# EasyEDA Pro project Proiect_PM.eprj

# Schematic ProiectPM

## Sheets
1 Anexa1: Unitatea Centrala: Board Name: Board1; Create Date: 2024-12-13; Page Name: Anexa1: Unitatea Centrala; Project Name: Proiect_PM; Schematic Name: ProiectPM; Update Date: 2025-01-07; Company: Universitatea Politehnica; Drawn: Duta Alexandru; Page Size: A4; Version: V1.0
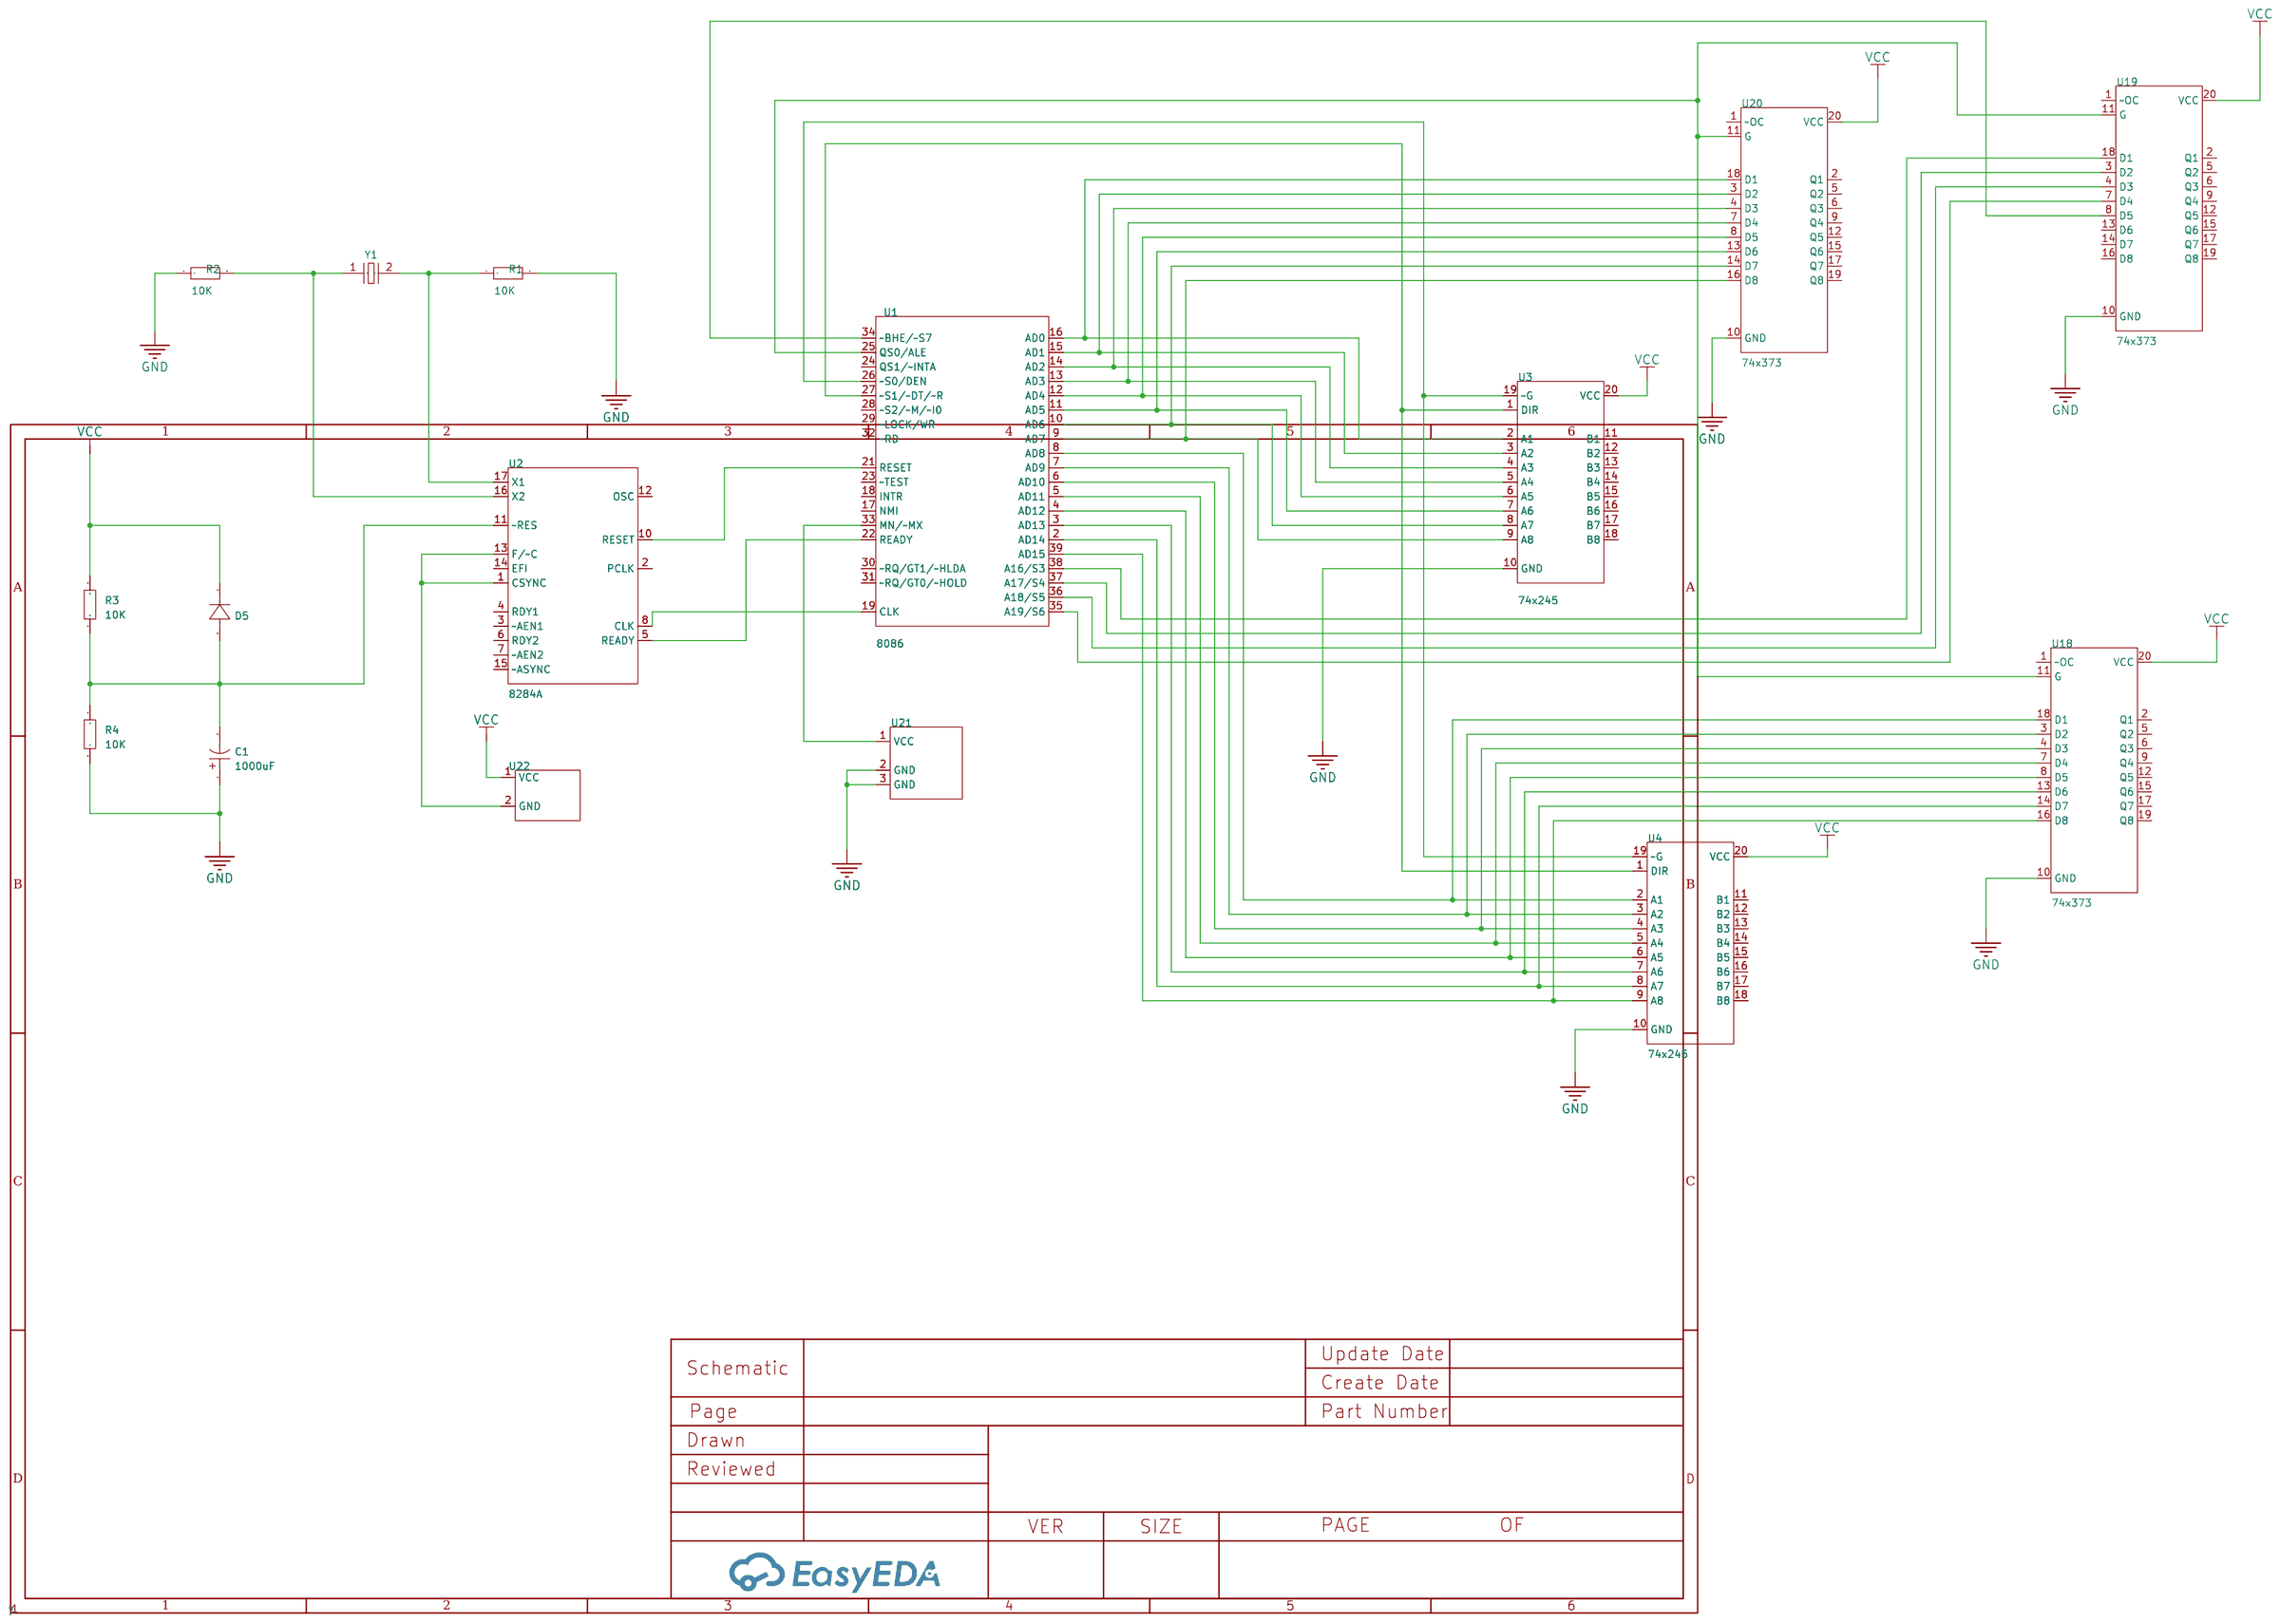
[diagram p0: Anexa1: Unitatea Centrala]
2 Anexa2:Memoriile: Create Date: 2024-12-15; Page Name: Anexa2:Memoriile
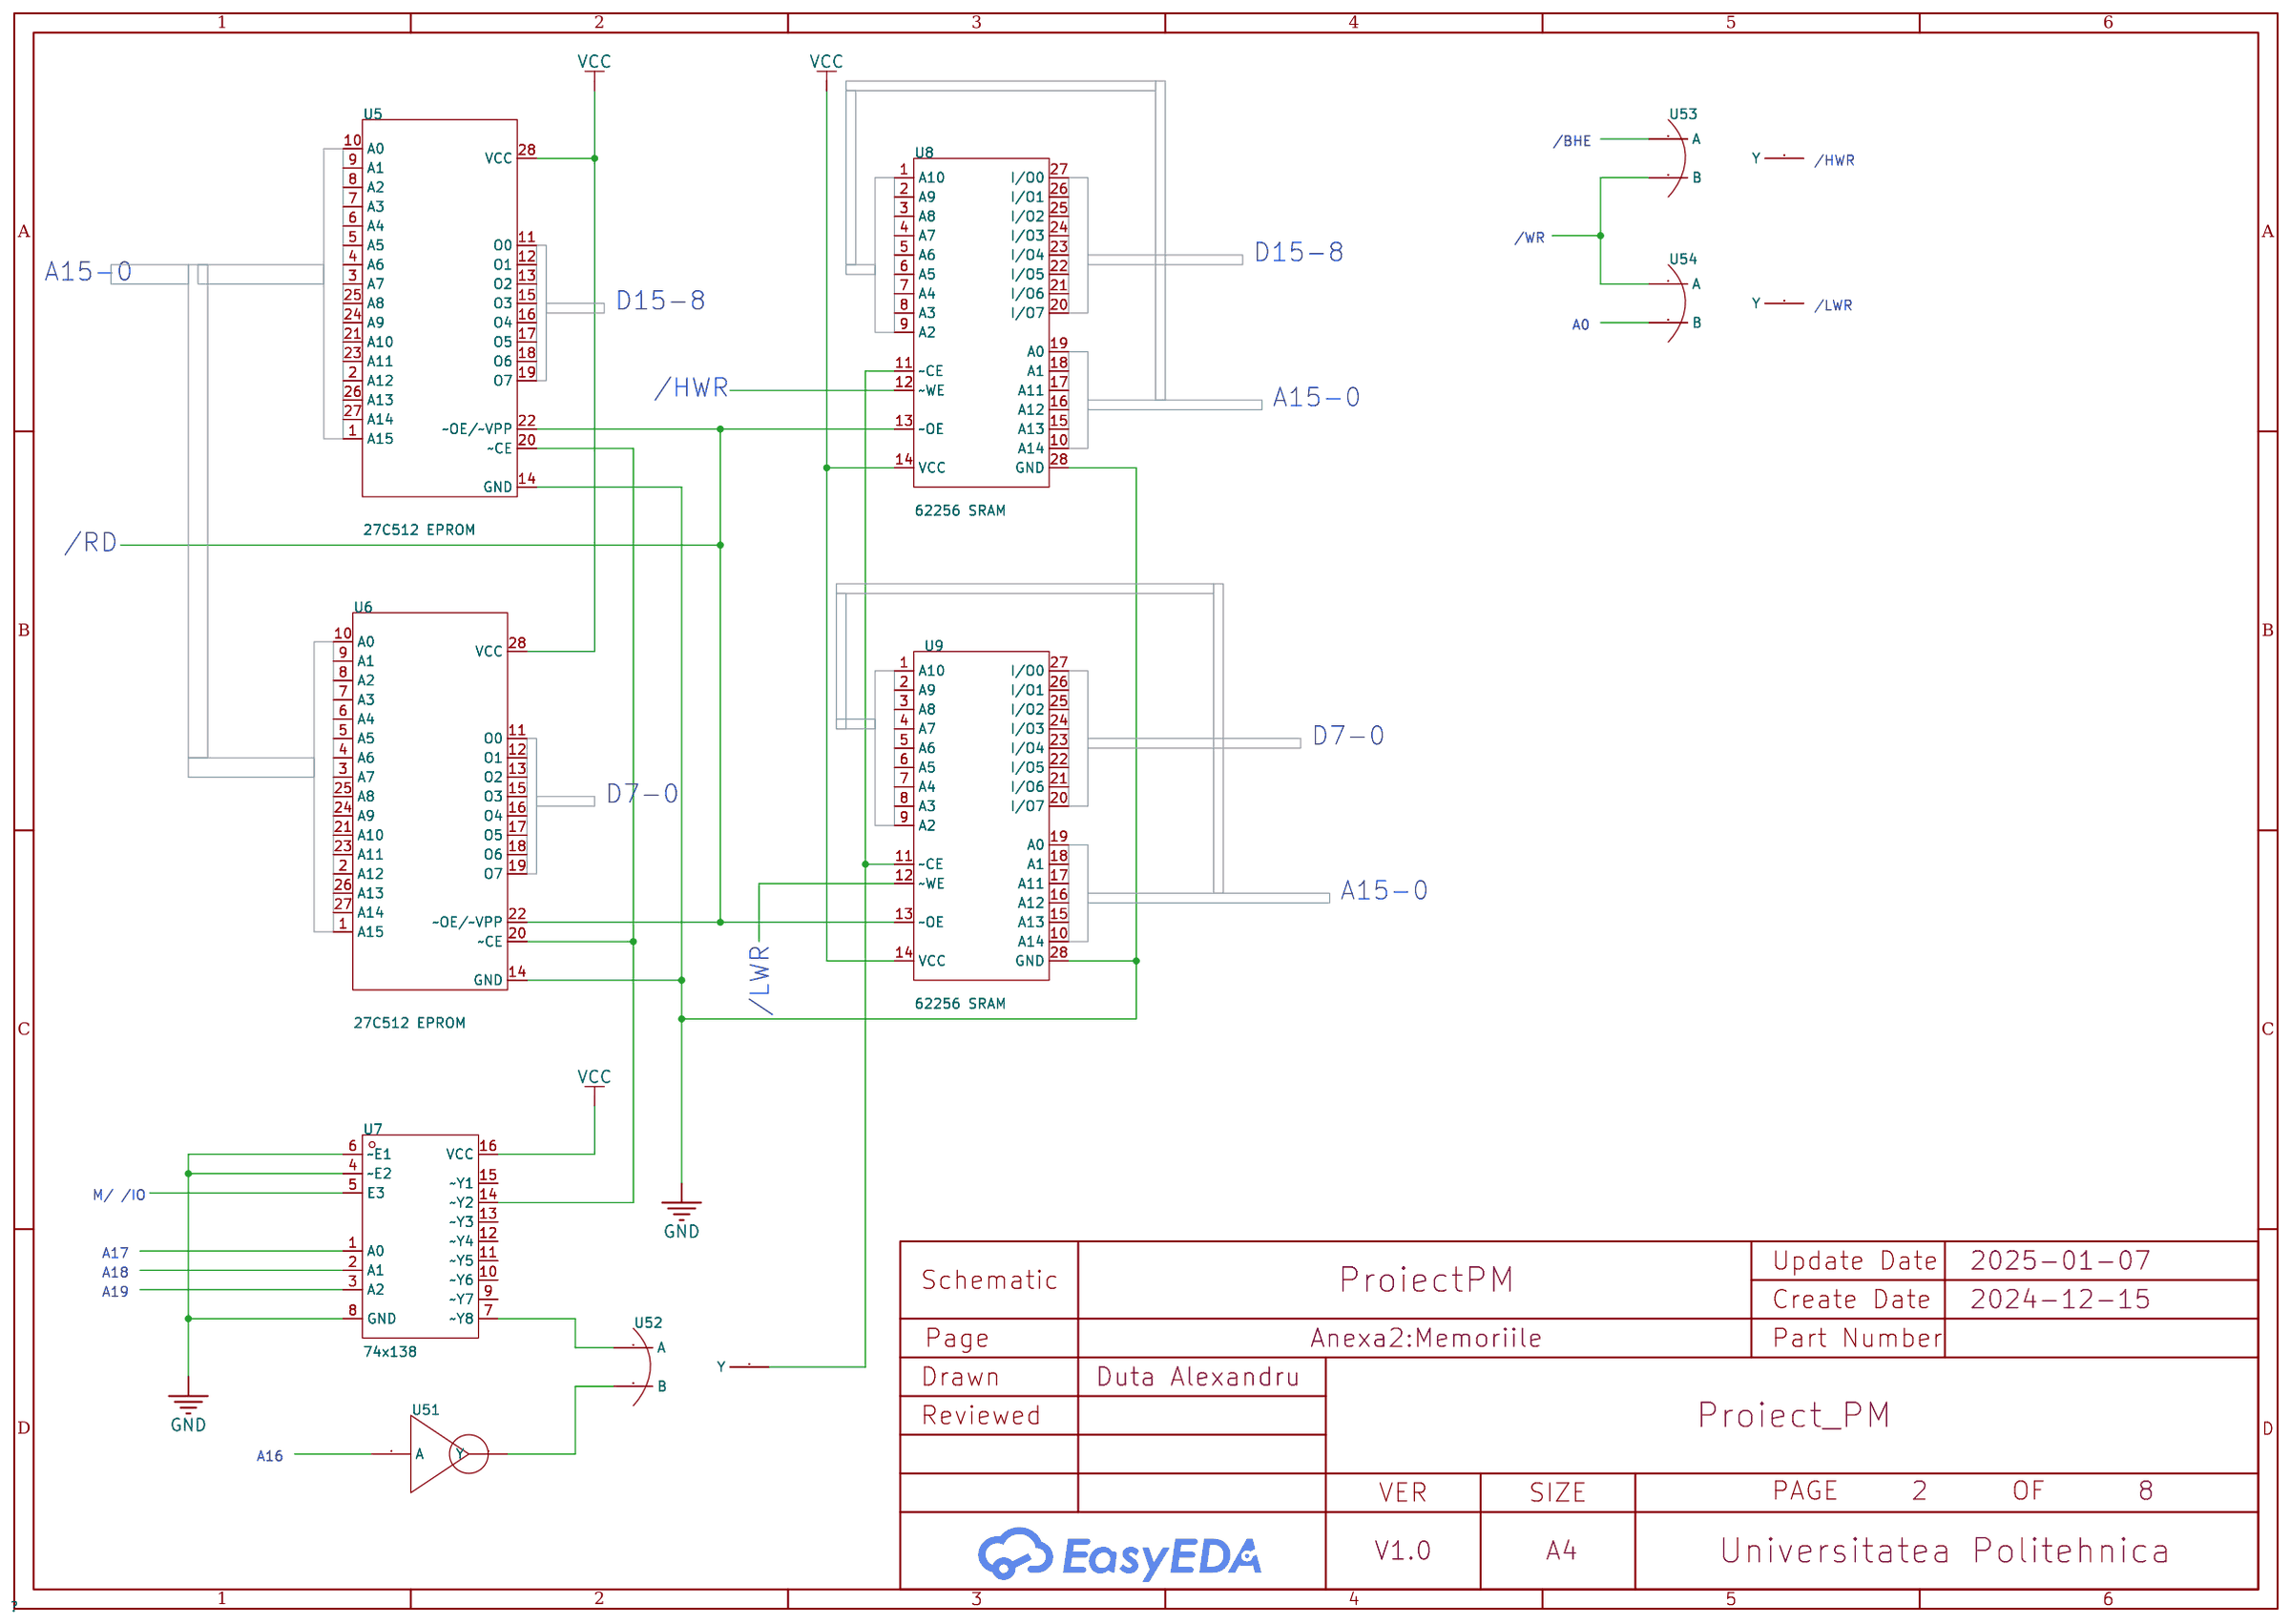
[diagram p1: Anexa2:Memoriile]
3 Anexa3:Decodificarea Porturilor: Create Date: 2024-12-15; Page Name: Anexa3:Decodificarea Porturilor
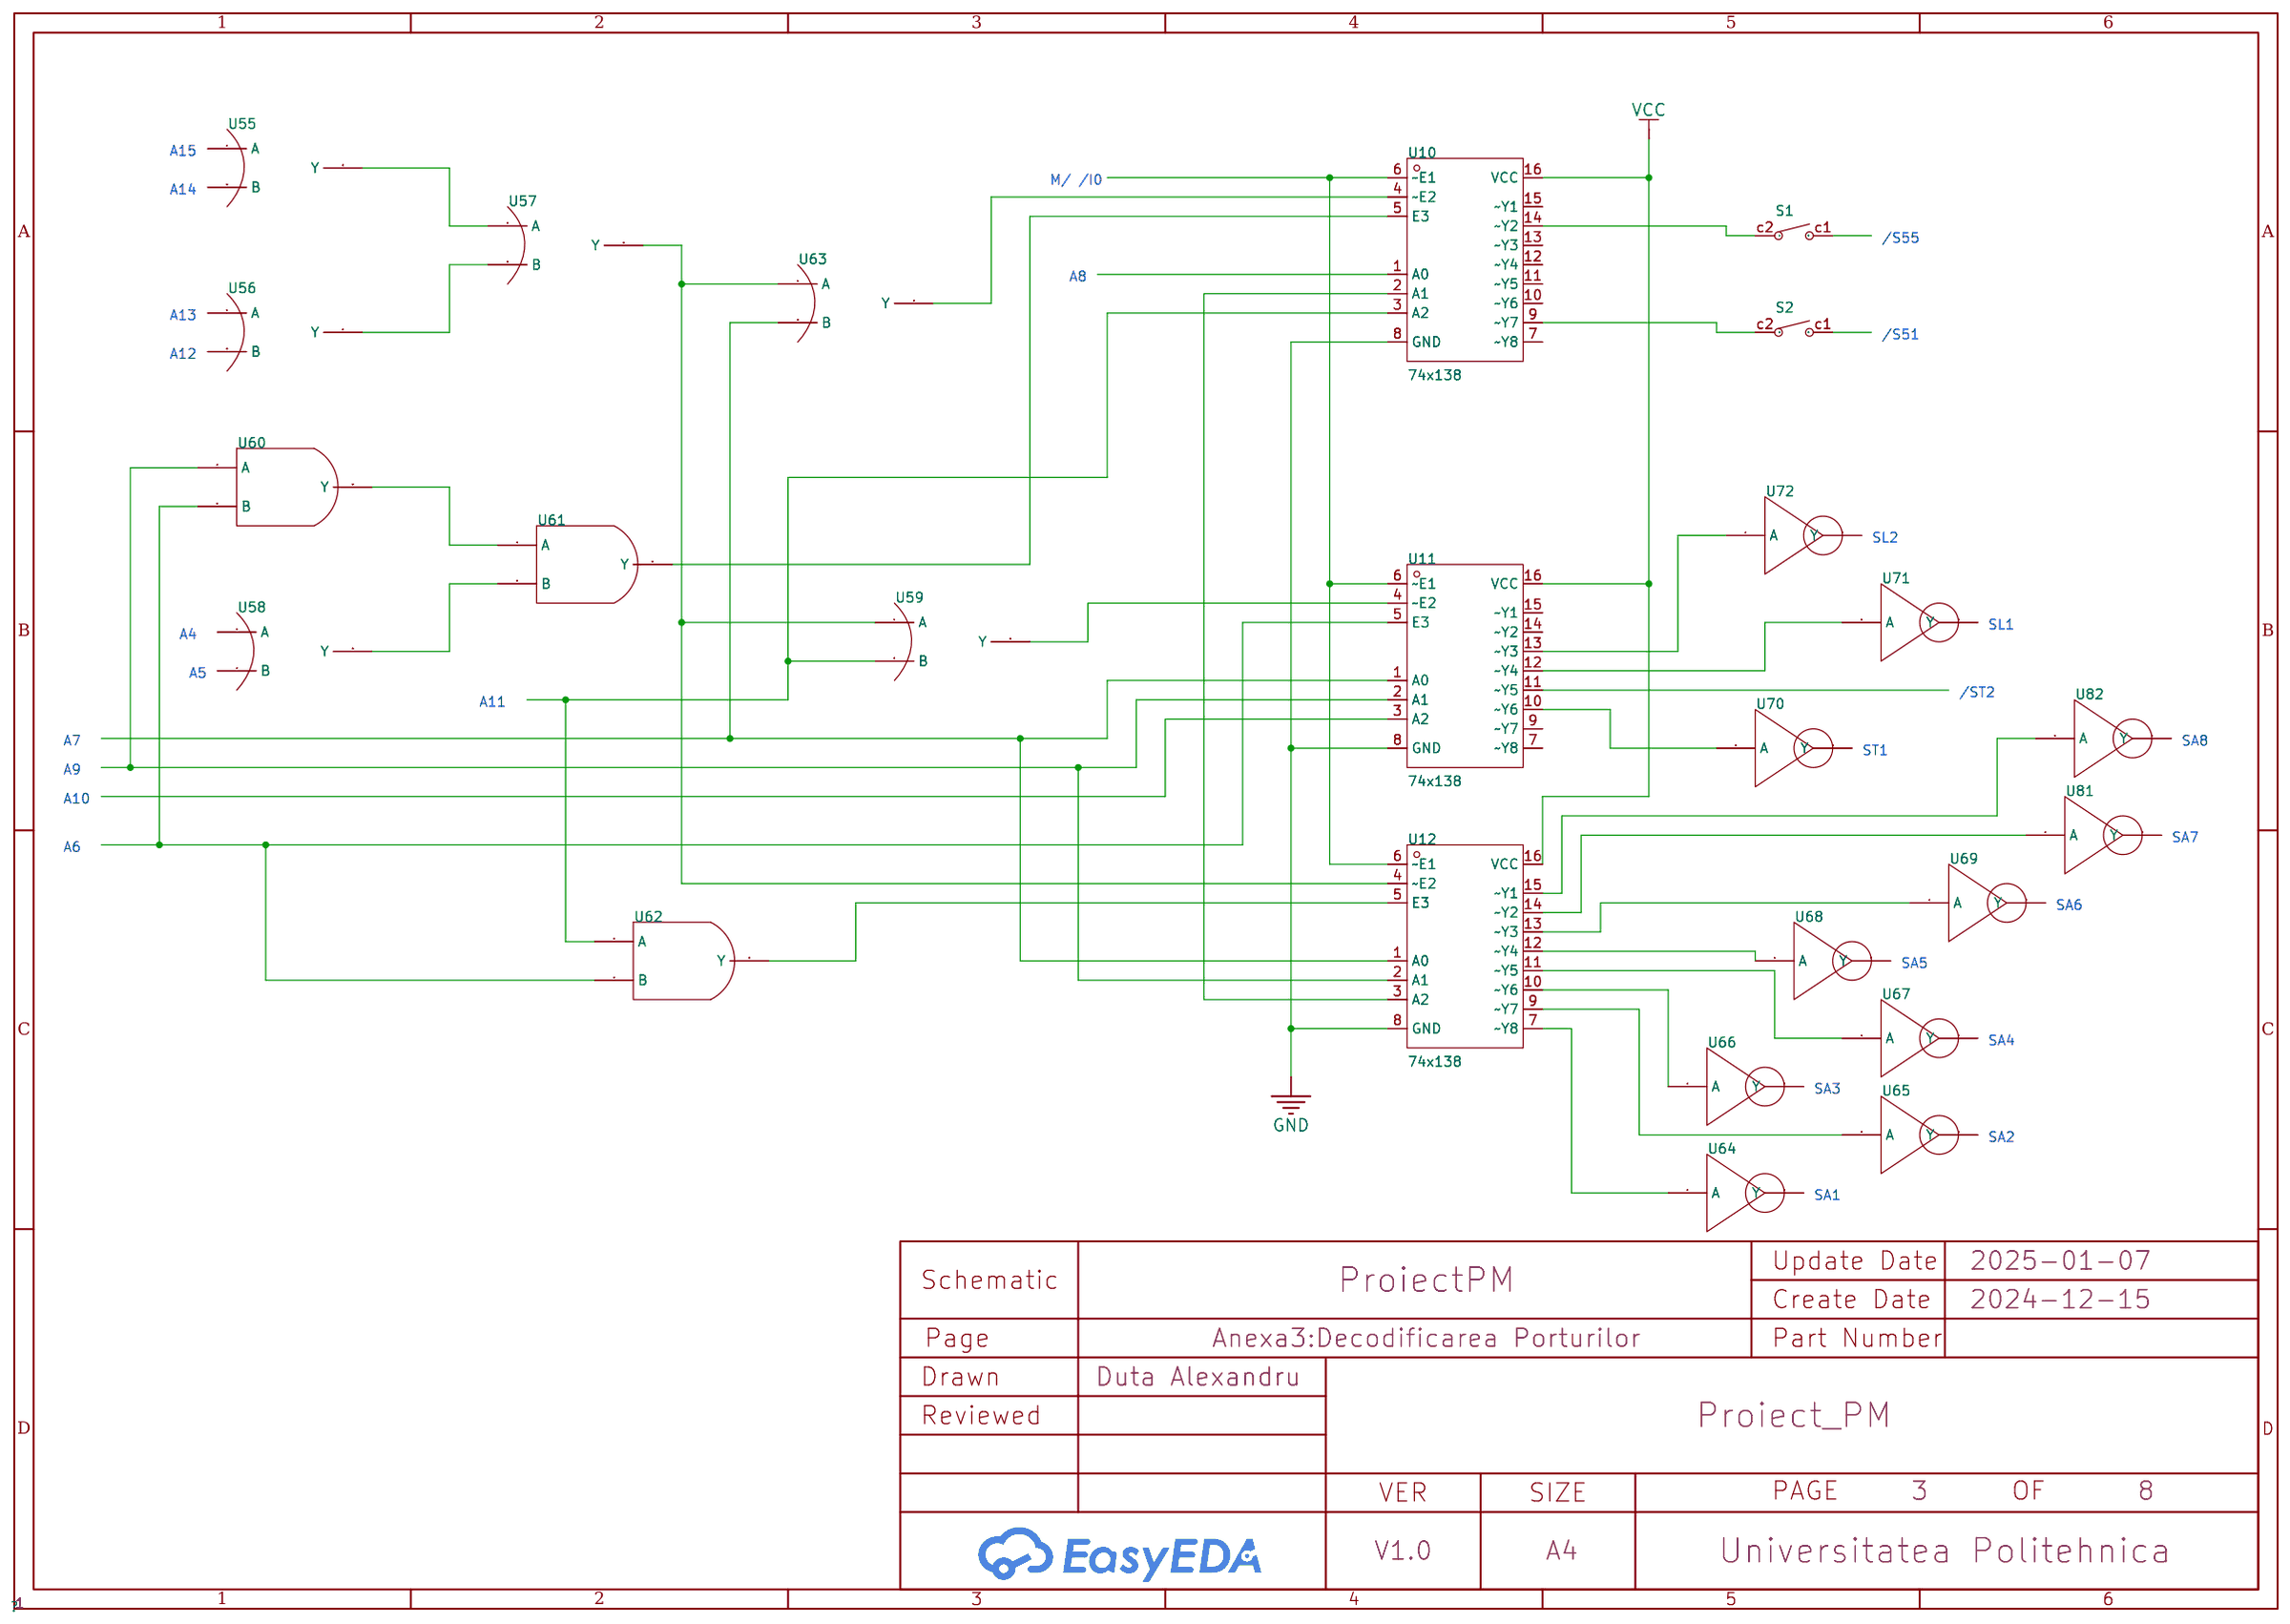
[diagram p2: Anexa3:Decodificarea Porturilor]
4 Anexa4:Interfetele: Create Date: 2024-12-15; Page Name: Anexa4:Interfetele; Update Date: 2024-12-17
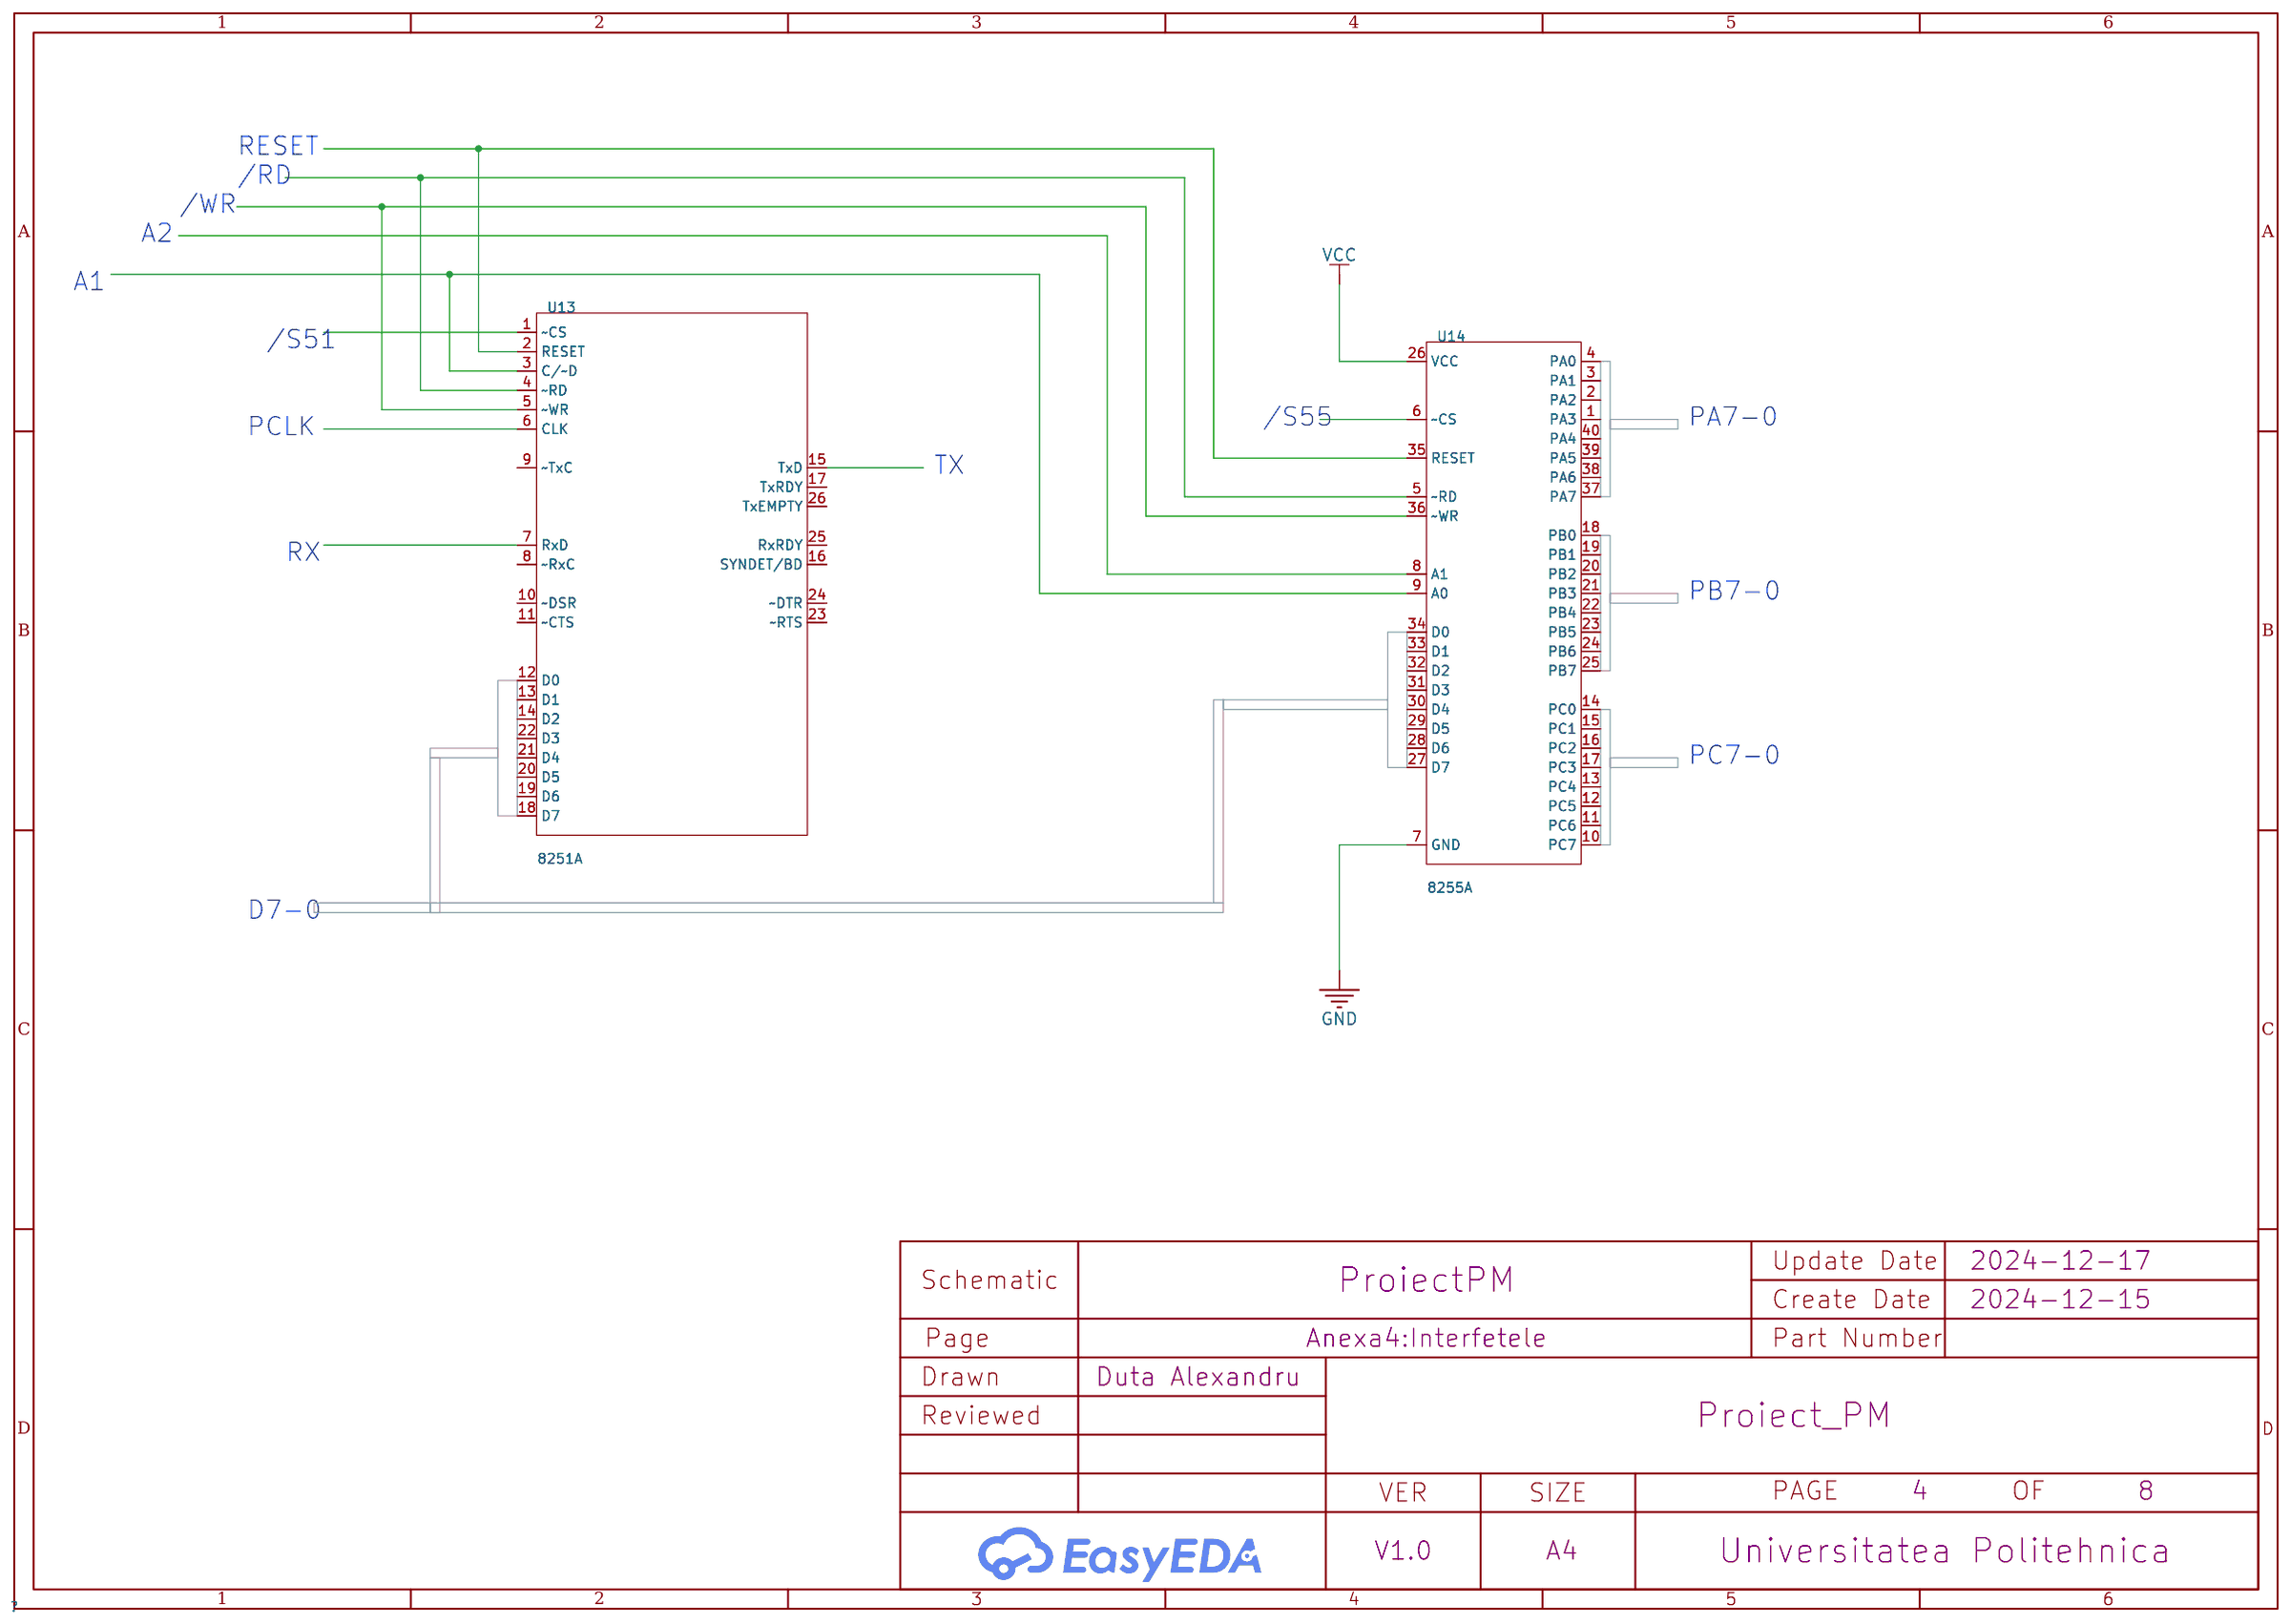
[diagram p3: Anexa4:Interfetele]
5 Anexa5:Led: Create Date: 2024-12-15; Page Name: Anexa5:Led
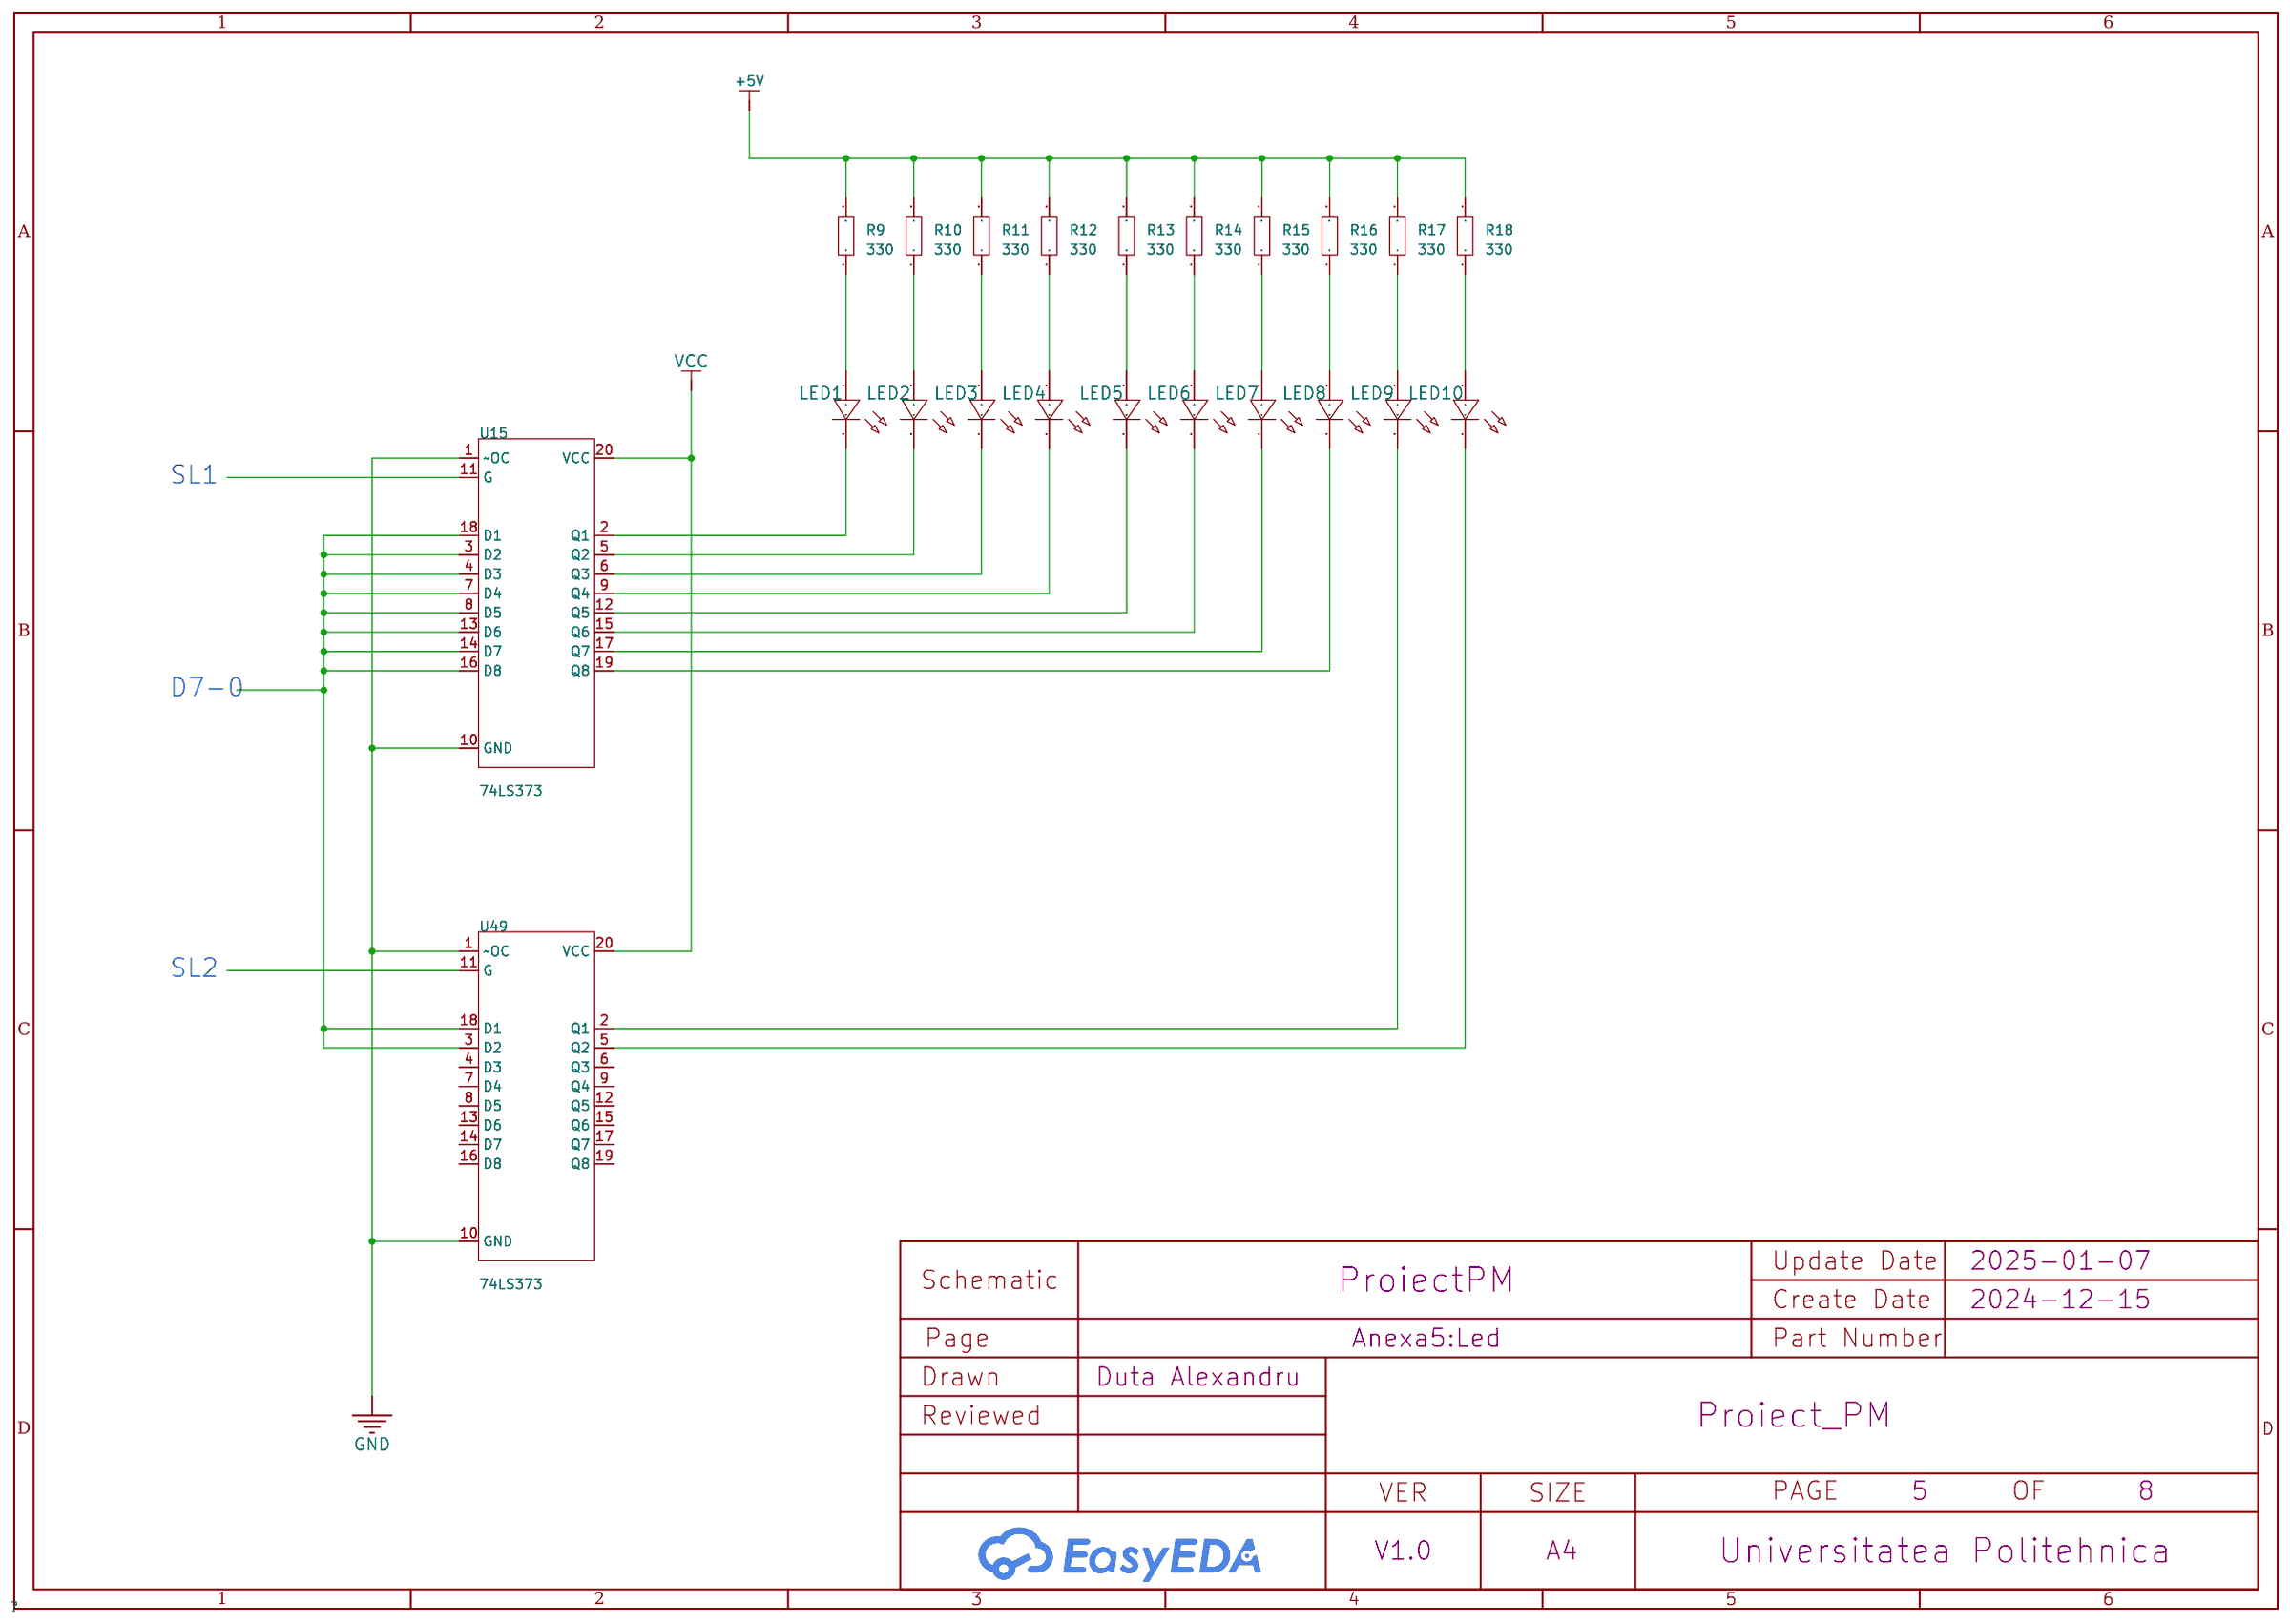
[diagram p4: Anexa5:Led]
6 Anexa7:Minitastatura cu 9 contacte: Create Date: 2024-12-15; Page Name: Anexa7:Minitastatura cu 9 contacte; Update Date: 2025-01-08; Company: EasyEDA.com
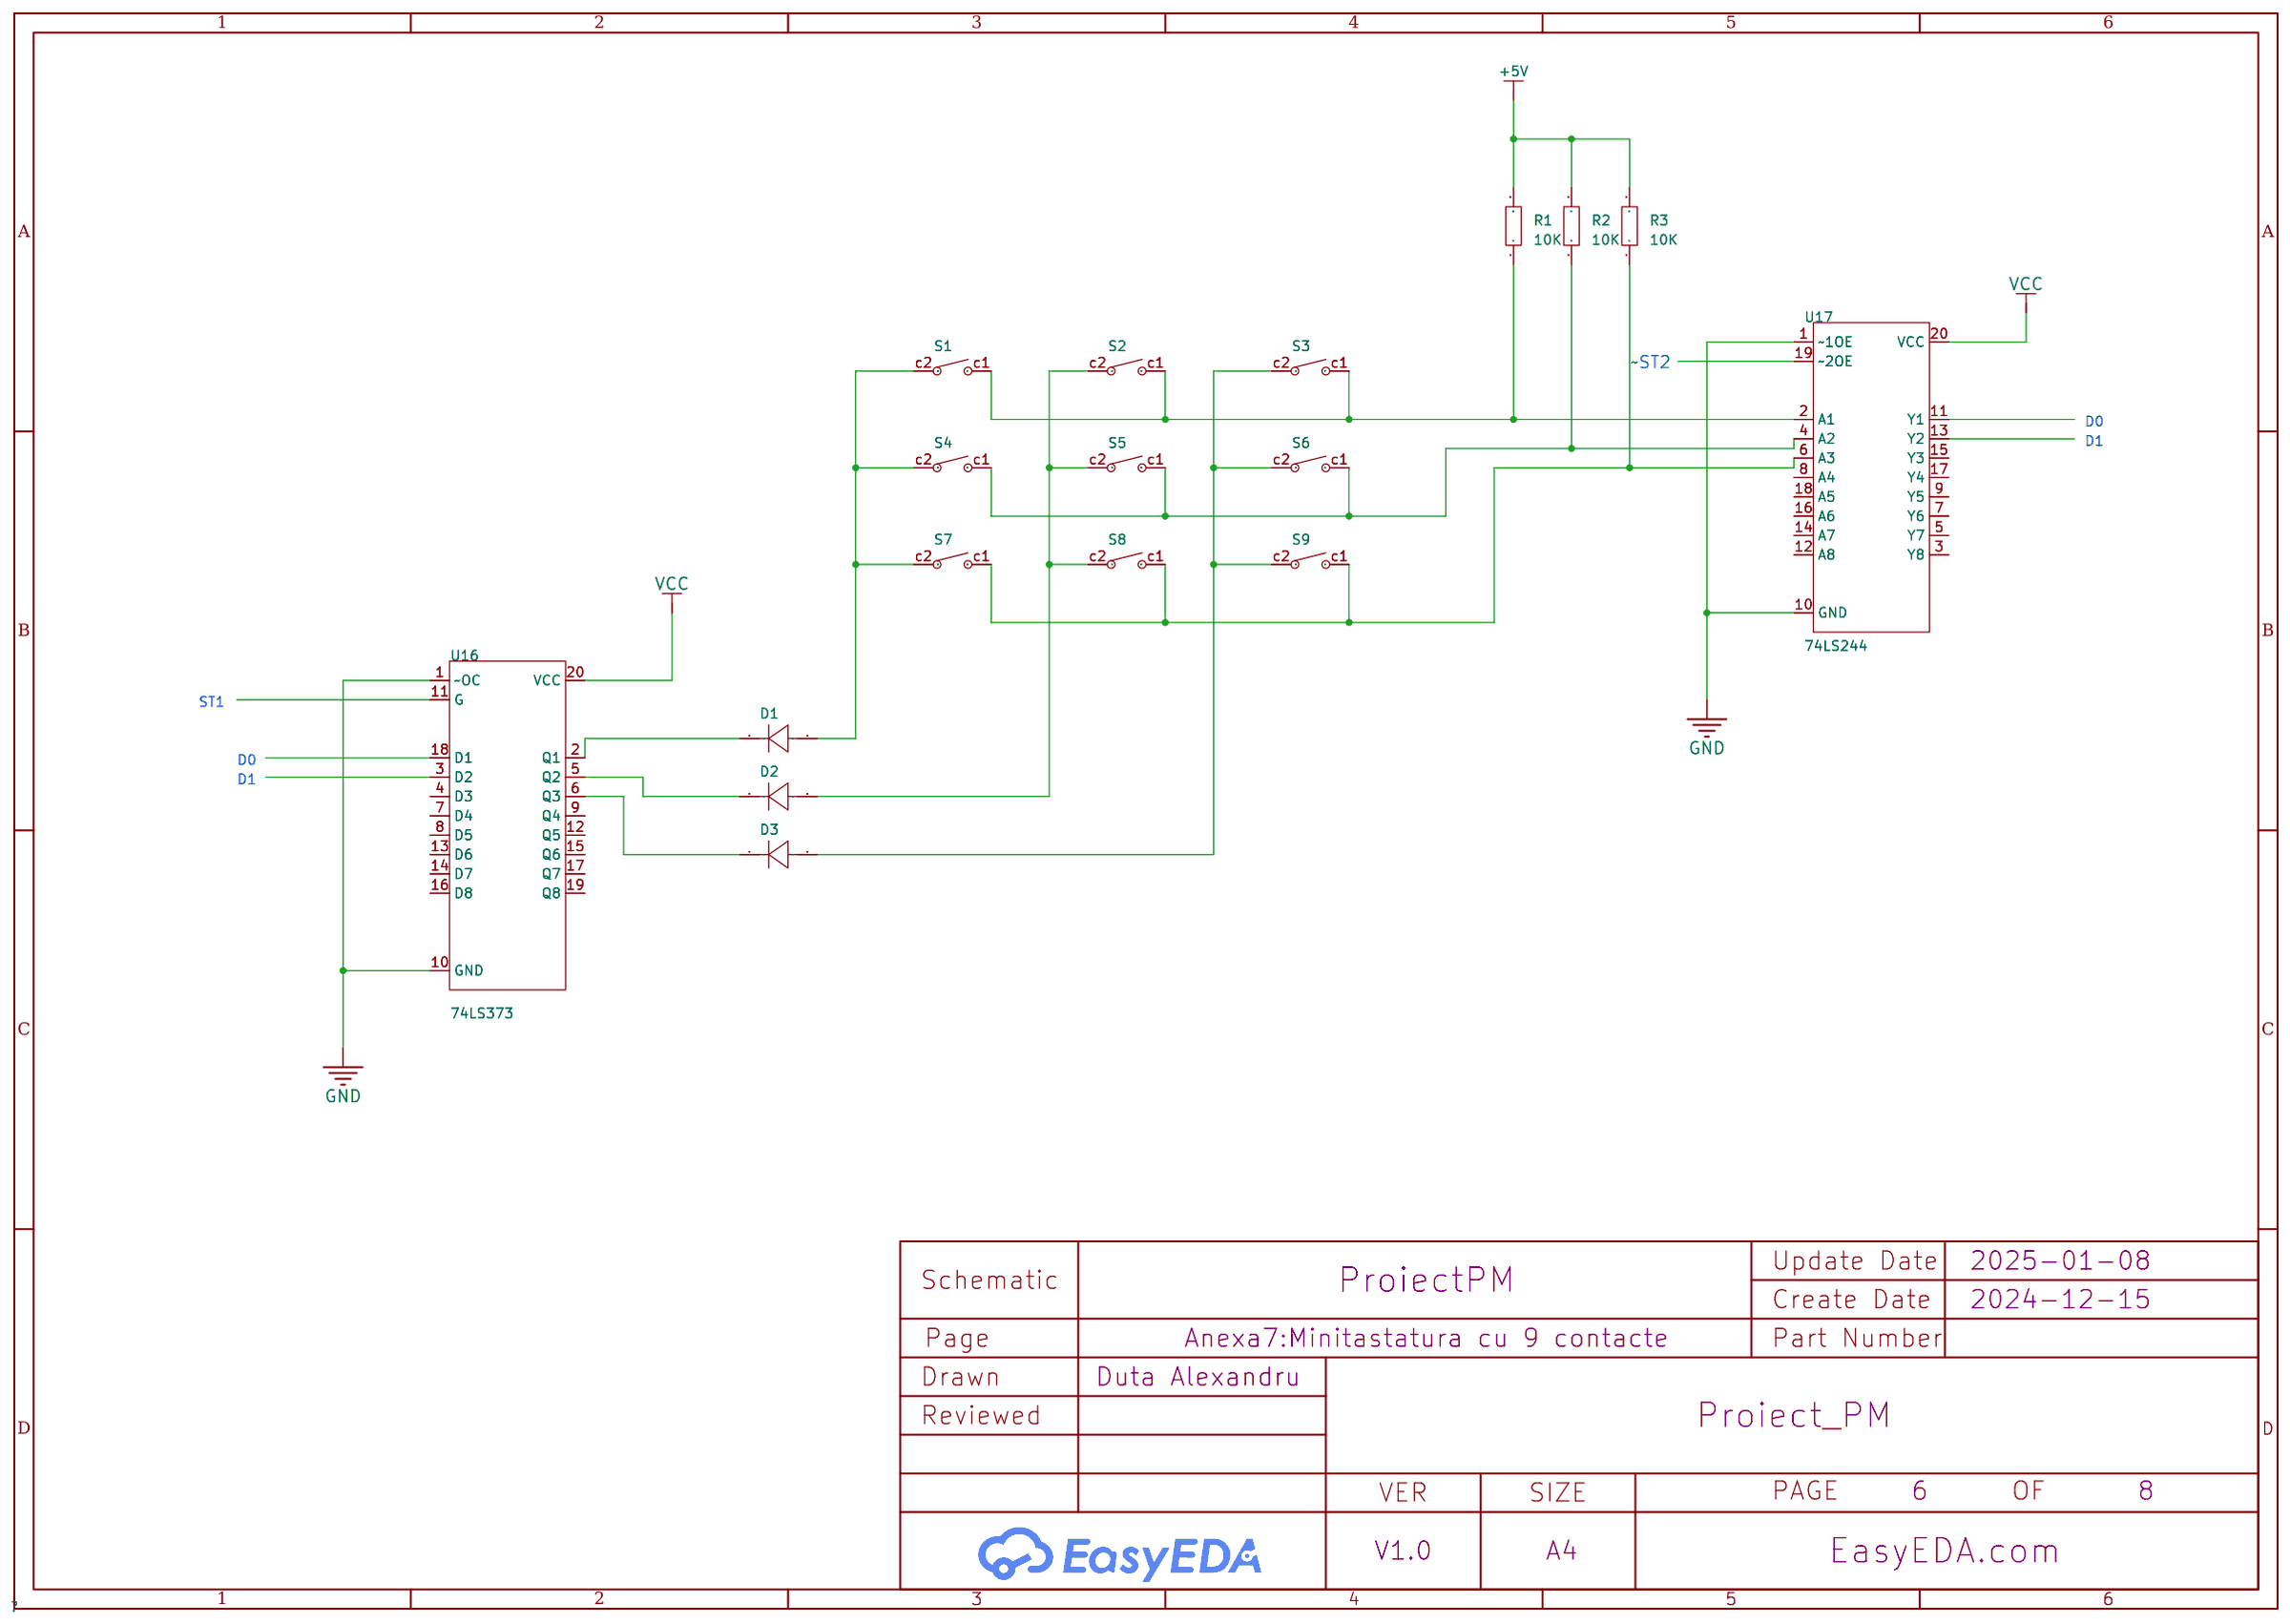
[diagram p5: Anexa7:Minitastatura cu 9 contacte]
7 Anexa6:Afisaj7segmente: Create Date: 2024-12-16; Page Name: Anexa6:Afisaj7segmente; Update Date: 2025-01-08; Page Size: A3
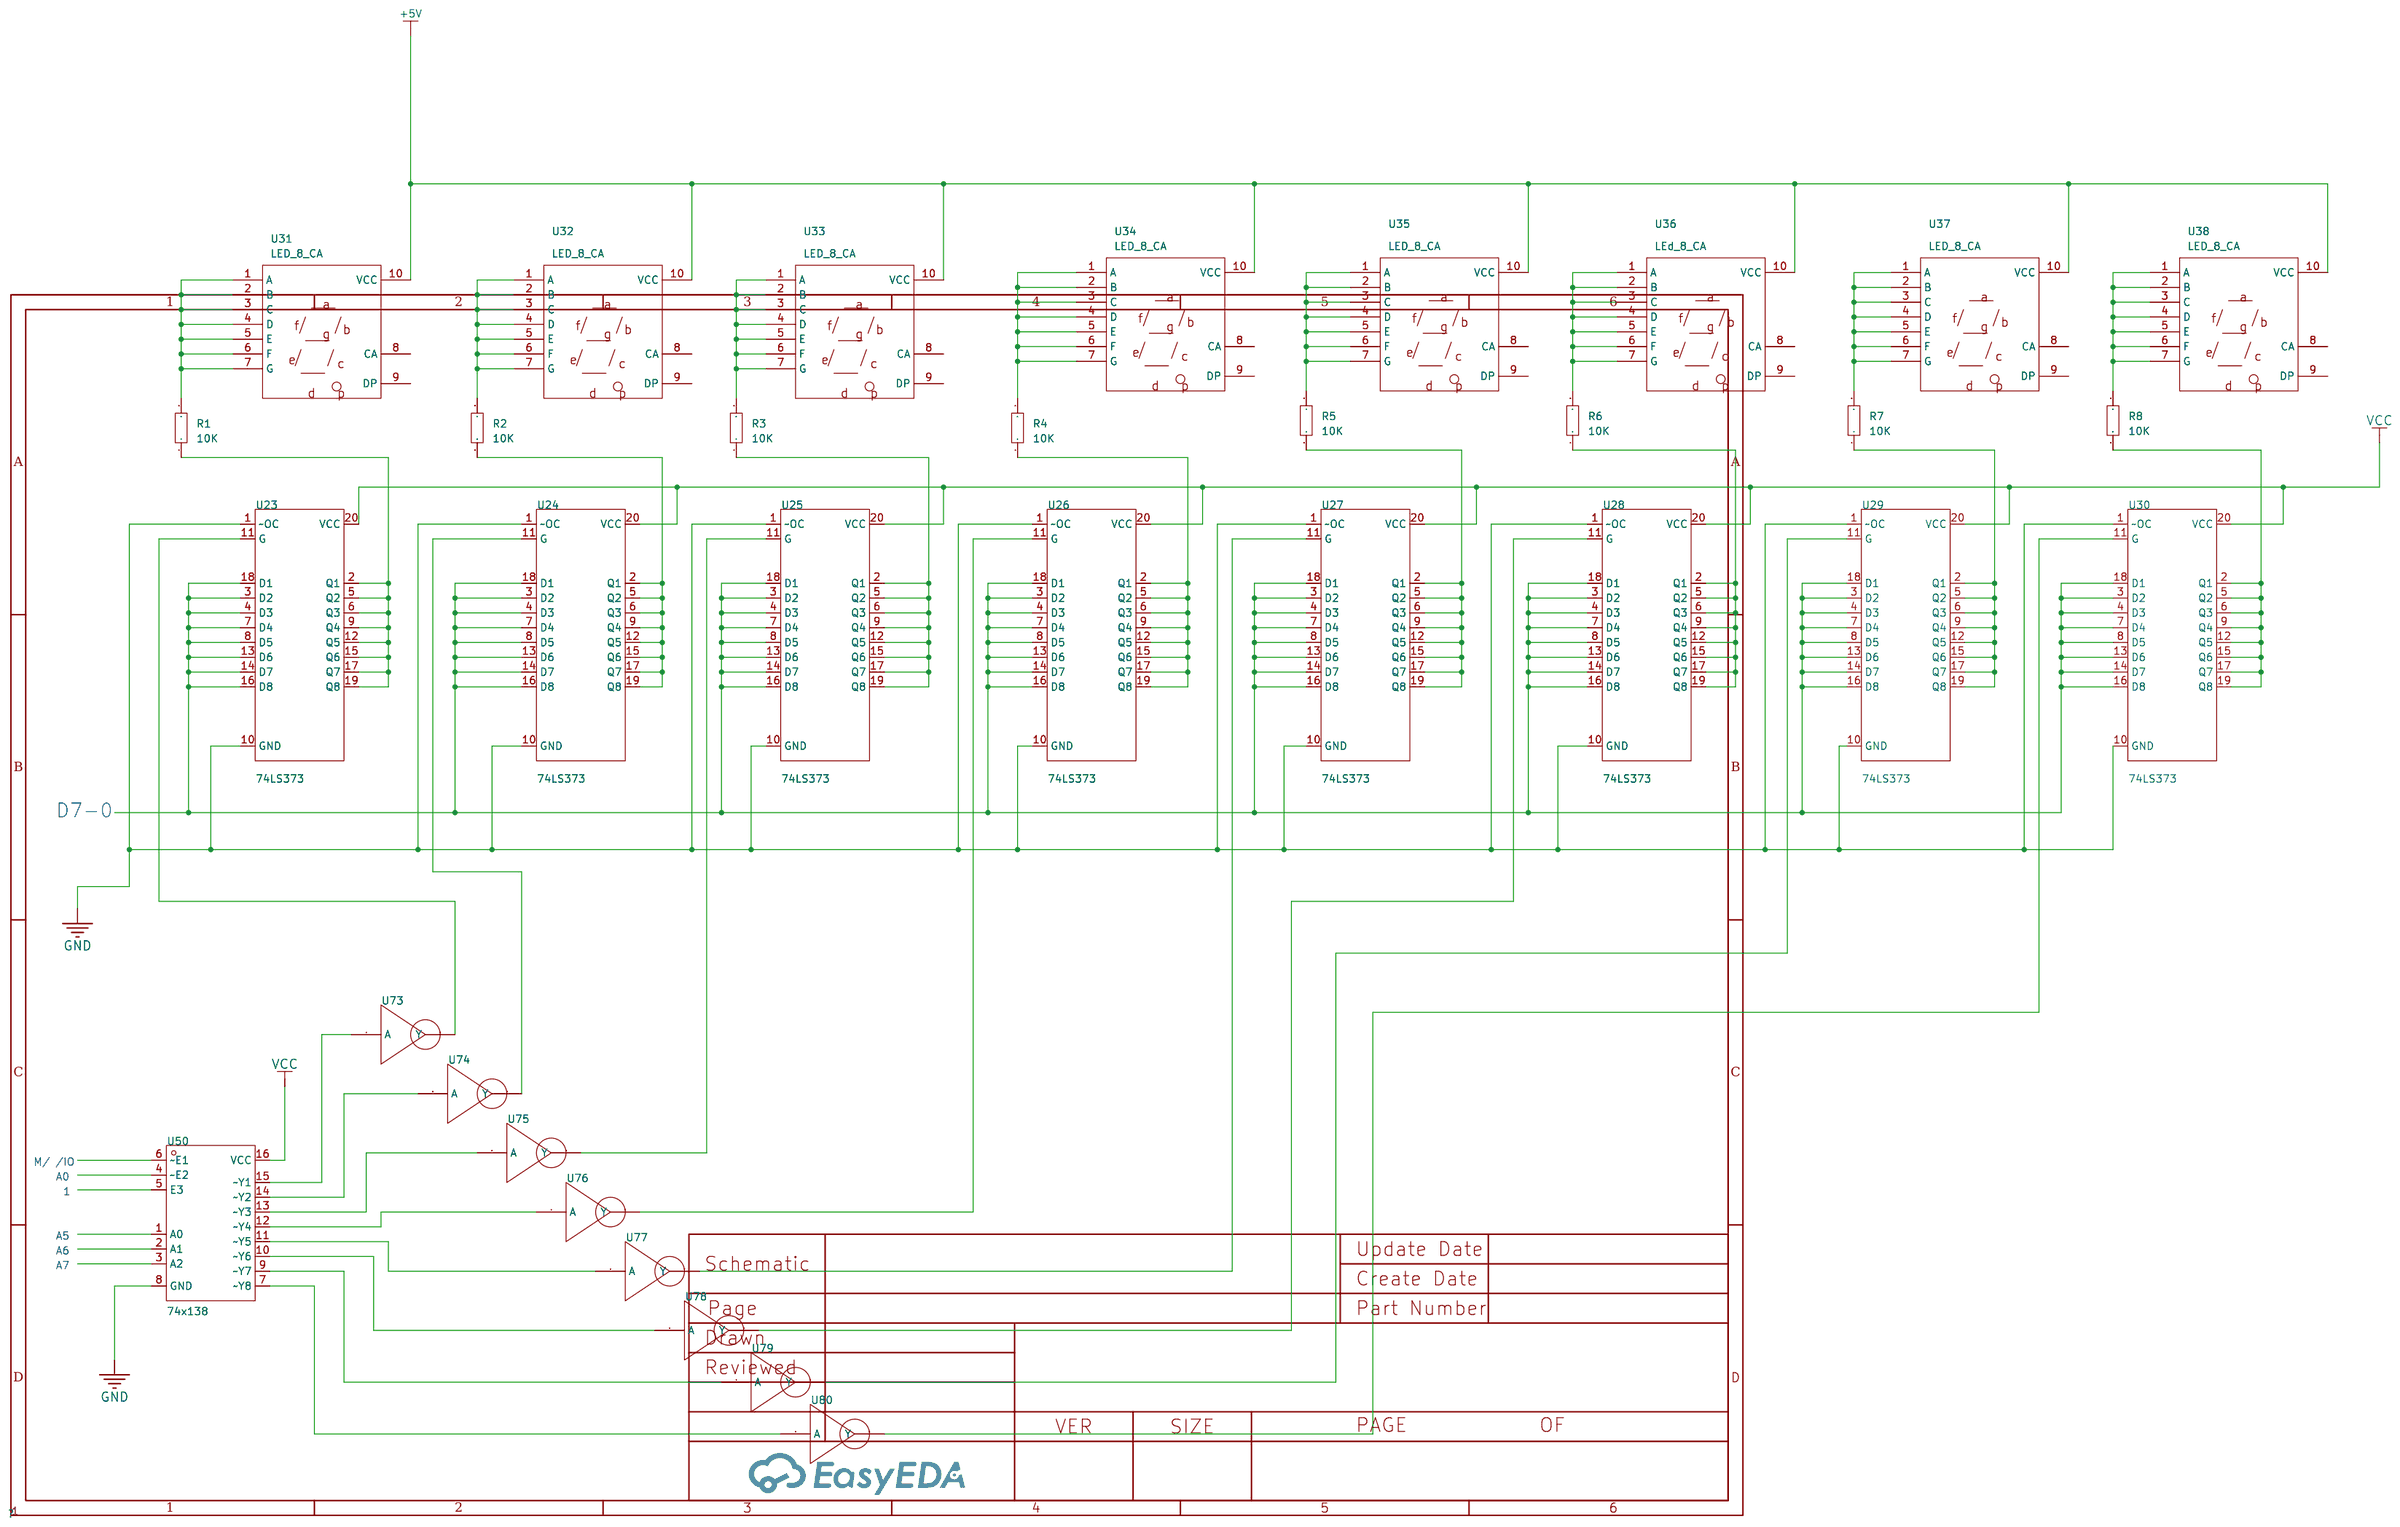
[diagram p6: Anexa6:Afisaj7segmente]
8 Anexa8:LCD: Create Date: 2024-12-16; Page Name: Anexa8:LCD; Update Date: 2025-01-03
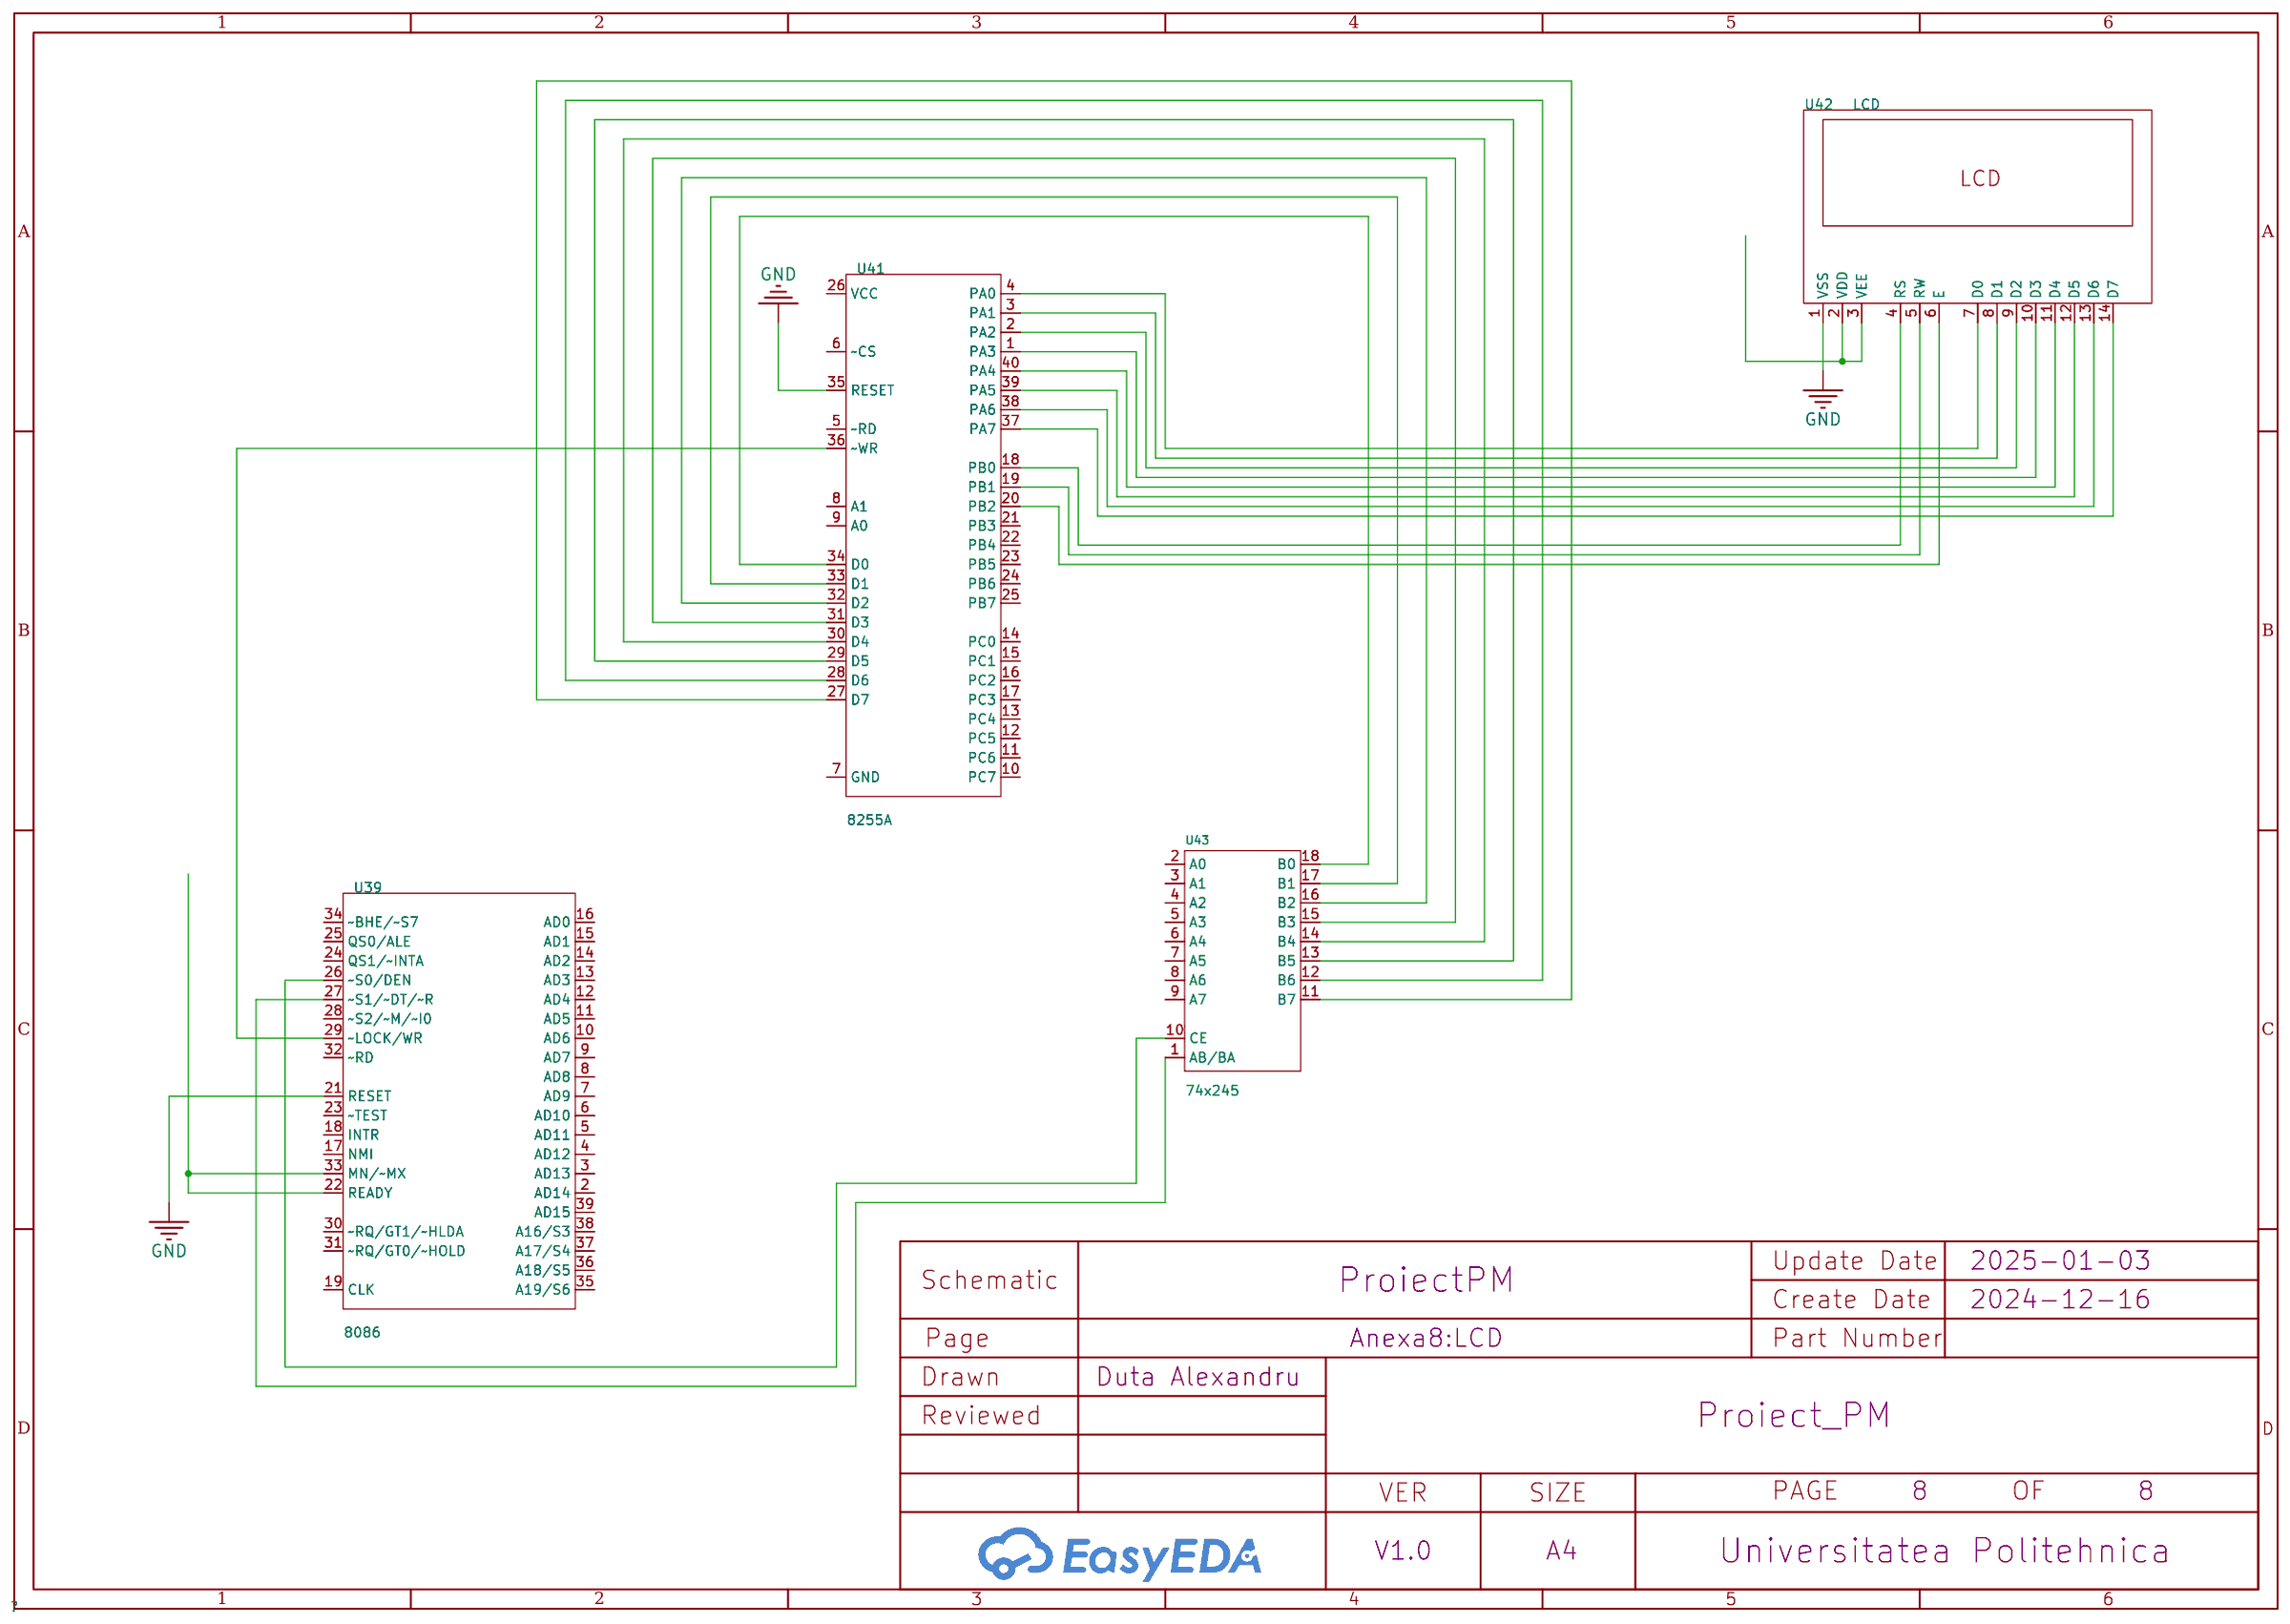
[diagram p7: Anexa8:LCD]

## Parts
sheet Anexa1: Unitatea Centrala
C1  1000uF  [CAP-TH_BD18.0-P7.5-D0.8-FD]
D5  -  [DO-41_BD2.4-L4.7-P8.70-D0.9-RD]
R1  10K  [R0603]
R2  10K  [R0603]
R3  10K  [R0603]
R4  10K  [R0603]
U1  8086  [PDIP-40_L52.3-W13.8-P2.54-LS15.2-BL]
U2  8284A  [CDIP-18_L24.4-W6.5-P2.54-LS7.6-BL]
U3  74x245  [SOIC-20_L13.0-W7.6-P1.27-LS10.3-BL]
U4  74x245  [SOIC-20_L13.0-W7.6-P1.27-LS10.3-BL]
U18  74x373  [PDIP-20_L25.9-W6.6-P2.54-LS7.9-BL]
U19  74x373  [PDIP-20_L25.9-W6.6-P2.54-LS7.9-BL]
U20  74x373  [PDIP-20_L25.9-W6.6-P2.54-LS7.9-BL]
U21  SIT8021AI-J4-18S-4.000000  [UFBGA-4_L1.6-W0.9-P0.41-TL_SIT8021AI-J4-XXS-2.048000]
U22  10MHz  [OSC-SMD_4P-L7.0-W5.0-BL_SIT1602]
Y1  DSX320G 8M 50PPM 8PF  [CRYSTAL-SMD_2P-L3.2-W2.5]
sheet Anexa2:Memoriile
U5  27C512 EPROM  [SOIC-28_L18.3-W8.6-P1.27-LS12.0-BL]
U6  27C512 EPROM  [SOIC-28_L18.3-W8.6-P1.27-LS12.0-BL]
U7  74x138  [SOIC-16_L9.9-W3.9-P1.27-LS6.0-BL]
U8  62256 SRAM  [TSOP-28_L11.8-W8.0-P0.55-LS13.4-B_CYPRESS]
U9  62256 SRAM  [TSOP-28_L11.8-W8.0-P0.55-LS13.4-B_CYPRESS]
U51  -
U52  -
U53  -
U54  -
sheet Anexa3:Decodificarea Porturilor
S1  SWITCH,TACT,1.57N,3.9X2.9MM  [KEY-SMD_L4.0-W3.0-LS4.9-1]
S2  SWITCH,TACT,1.57N,3.9X2.9MM  [KEY-SMD_L4.0-W3.0-LS4.9-1]
U10  74x138  [SOIC-16_L9.9-W3.9-P1.27-LS6.0-BL]
U11  74x138  [SOIC-16_L9.9-W3.9-P1.27-LS6.0-BL]
U12  74x138  [SOIC-16_L9.9-W3.9-P1.27-LS6.0-BL]
U55  -
U56  -
U57  -
U58  -
U59  -
U60  -
U61  -
U62  -
U63  -
U64  -
U65  -
U66  -
U67  -
U68  -
U69  -
U70  -
U71  -
U72  -
U81  -
U82  -
sheet Anexa4:Interfetele
U13  8251A  [PDIP-28_L35.0-W7.3-P2.54-LS7.8-BL]
U14  8255A  [PDIP-40_L52.3-W13.8-P2.54-LS15.2-BL]
sheet Anexa5:Led
LED1  -  [LED0402-RD_YELLOW]
LED2  -  [LED0402-RD_YELLOW]
LED3  -  [LED0402-RD_YELLOW]
LED4  -  [LED0402-RD_YELLOW]
LED5  -  [LED0402-RD_YELLOW]
LED6  -  [LED0402-RD_YELLOW]
LED7  -  [LED0402-RD_YELLOW]
LED8  -  [LED0402-RD_YELLOW]
LED9  -  [LED0402-RD_YELLOW]
LED10  -  [LED0402-RD_YELLOW]
R9  330  [R0603]
R10  330  [R0603]
R11  330  [R0603]
R12  330  [R0603]
R13  330  [R0603]
R14  330  [R0603]
R15  330  [R0603]
R16  330  [R0603]
R17  330  [R0603]
R18  330  [R0603]
U15  74LS373  [PDIP-20_L25.9-W6.6-P2.54-LS7.9-BL]
U49  74LS373  [PDIP-20_L25.9-W6.6-P2.54-LS7.9-BL]
sheet Anexa6:Afisaj7segmente
R1#3  10K  [R0603]
R2#3  10K  [R0603]
R3#3  10K  [R0603]
R4#2  10K  [R0603]
R5  10K  [R0603]
R6  10K  [R0603]
R7  10K  [R0603]
R8  10K  [R0603]
U23  74LS373  [PDIP-20_L25.9-W6.6-P2.54-LS7.9-BL]
U24  74LS373  [PDIP-20_L25.9-W6.6-P2.54-LS7.9-BL]
U25  74LS373  [PDIP-20_L25.9-W6.6-P2.54-LS7.9-BL]
U26  74LS373  [PDIP-20_L25.9-W6.6-P2.54-LS7.9-BL]
U27  74LS373  [PDIP-20_L25.9-W6.6-P2.54-LS7.9-BL]
U28  74LS373  [PDIP-20_L25.9-W6.6-P2.54-LS7.9-BL]
U29  74LS373  [PDIP-20_L25.9-W6.6-P2.54-LS7.9-BL]
U30  74LS373  [PDIP-20_L25.9-W6.6-P2.54-LS7.9-BL]
U31  LED_8_CA  [LED-SEG-SMD_L10.0-W6.9-P1.44-LS10.0-BR]
U32  LED_8_CA  [LED-SEG-SMD_L10.0-W6.9-P1.44-LS10.0-BR]
U33  LED_8_CA  [LED-SEG-SMD_L10.0-W6.9-P1.44-LS10.0-BR]
U34  LED_8_CA  [LED-SEG-SMD_L10.0-W6.9-P1.44-LS10.0-BR]
U35  LED_8_CA  [LED-SEG-SMD_L10.0-W6.9-P1.44-LS10.0-BR]
U36  LEd_8_CA  [LED-SEG-SMD_L10.0-W6.9-P1.44-LS10.0-BR]
U37  LED_8_CA  [LED-SEG-SMD_L10.0-W6.9-P1.44-LS10.0-BR]
U38  LED_8_CA  [LED-SEG-SMD_L10.0-W6.9-P1.44-LS10.0-BR]
U50  74x138  [SOIC-16_L9.9-W3.9-P1.27-LS6.0-BL]
U73  -
U74  -
U75  -
U76  -
U77  -
U78  -
U79  -
U80  -
sheet Anexa7:Minitastatura cu 9 contacte
D1  -  [DO-41_BD2.4-L4.7-P8.70-D0.9-RD]
D2  -  [DO-41_BD2.4-L4.7-P8.70-D0.9-RD]
D3  -  [DO-41_BD2.4-L4.7-P8.70-D0.9-RD]
R1#2  10K  [R0603]
R2#2  10K  [R0603]
R3#2  10K  [R0603]
S1#2  SWITCH,TACT,1.57N,3.9X2.9MM  [KEY-SMD_L4.0-W3.0-LS4.9-1]
S2#2  SWITCH,TACT,1.57N,3.9X2.9MM  [KEY-SMD_L4.0-W3.0-LS4.9-1]
S3  SWITCH,TACT,1.57N,3.9X2.9MM  [KEY-SMD_L4.0-W3.0-LS4.9-1]
S4  SWITCH,TACT,1.57N,3.9X2.9MM  [KEY-SMD_L4.0-W3.0-LS4.9-1]
S5  SWITCH,TACT,1.57N,3.9X2.9MM  [KEY-SMD_L4.0-W3.0-LS4.9-1]
S6  SWITCH,TACT,1.57N,3.9X2.9MM  [KEY-SMD_L4.0-W3.0-LS4.9-1]
S7  SWITCH,TACT,1.57N,3.9X2.9MM  [KEY-SMD_L4.0-W3.0-LS4.9-1]
S8  SWITCH,TACT,1.57N,3.9X2.9MM  [KEY-SMD_L4.0-W3.0-LS4.9-1]
S9  SWITCH,TACT,1.57N,3.9X2.9MM  [KEY-SMD_L4.0-W3.0-LS4.9-1]
U16  74LS373  [PDIP-20_L25.9-W6.6-P2.54-LS7.9-BL]
U17  74LS244  [SOIC-20_L13.3-W5.5-P1.27-LS7.8-BL]
sheet Anexa8:LCD
U39  8086  [PDIP-40_L52.3-W13.8-P2.54-LS15.2-BL]
U41  8255A  [PDIP-40_L52.3-W13.8-P2.54-LS15.2-BL]
U42  LCD  [LCD-TH_C9900094568]
U43  74x245  [DIP-20_L26.8-W6.4-P2.54-LS7.6-BL]

## Library data of the parts
C1 = UHE1V102MHD6: LCSC Part Name: 1000uF ±20% 35V; Supplier Part: C1581659; Manufacturer: Nichicon(尼吉康); Supplier Footprint: 插件,D18xL15mm; JLCPCB Part Class: Extended Part; Datasheet: https://atta.szlcsc.com/upload/public/pdf/source/20211025/B93034CA05E6F05F110E231C596F7633.pdf; Supplier: LCSC; Tolerance: ±20%; Ripple Current: 1.658A@120Hz; Equivalent Series Resistance(ESR): 43mΩ; Lifetime @ Temp: 10000hrs@105℃; Operating Temperature: -40℃~+105℃
D1-D3 D5 = 1N4007: Supplier Footprint: DO-41
R1 R1#2 R1#3 R2 R2#2 R2#3 R3 R3#2 R3#3 R4 R4#2 R5-R18 = Res_0603: Supplier Footprint: 0603
U1 U39 = 8086-2/BQA: CPU Core:- CPU Maximum Speed:8MHz Operating Temperature Range:-55℃~+125℃ Operating Temperature Range:-55℃~+125℃; Supplier Part: C3229526; Manufacturer: AMD(超微); Supplier Footprint: CDIP-40; JLCPCB Part Class: Extended Part; Datasheet: https://atta.szlcsc.com/upload/public/pdf/source/20240402/FE35119881CB502F4EE6944C35A1E6D9.pdf; Supplier: LCSC; CPU Maximum Speed: 8MHz; Operating Temperature Range: -55℃~+125℃
U2 = MD8284A/B: Supplier Part: C3610662; Manufacturer: Rochester Electronics(罗彻斯特); JLCPCB Part Class: Extended Part; Supplier: LCSC
U3 U4 = 74LS245WMX: LCSC Part Name: 74LS245WMX  停产; Supplier Part: C6034; Supplier Footprint: SOIC-20-300mil; JLCPCB Part Class: Extended Part; Supplier: LCSC
U15 U16 U18-U20 U23-U30 U49 = SN74LS373NE4: Supplier Part: C20345770; Manufacturer: TI(德州仪器); Supplier Footprint: PDIP-20; JLCPCB Part Class: Extended Part; Datasheet: https://atta.szlcsc.com/upload/public/pdf/source/20240124/40B28E085B2AB8D9BBBD759A3B5E9DDC.pdf; Supplier: LCSC
U21 = SIT8021AI-J4-18S-4.000000: Supplier Part: C17307115; Manufacturer: SITIME; Supplier Footprint: UFBGA-4; JLCPCB Part Class: Extended Part; Datasheet: https://atta.szlcsc.com/upload/public/pdf/source/20231207/FBED864CA47706BD91841653E684E891.pdf; Supplier: LCSC
U22 = DV75C-010.0M: Frequency: Frequency Stability:±280ppb Frequency Stability:±280ppb Output Type:LVCMOS Supply Voltage:3.3V Supply Voltage:3.3V Supply Current (Max): Operating Temperature: Operating Temperature:; LCSC Part Name: 10MHz ±280ppb 3.3V; Supplier Part: C6226547; Manufacturer: Connor-Winfield; Supplier Footprint: SMD7050-4P; JLCPCB Part Class: Extended Part; Supplier: LCSC; Frequency Stability: ±280ppb; Output Type: LVCMOS; Supply Voltage: 3.3V
Y1 = DSX320G 8M 50PPM 8PF: Supplier Part: C9900088404; Supplier Footprint: CRYSTAL2P-3225; JLCPCB Part Class: Extended Part; Supplier: LCSC
U5 U6 = AT27C512R-70RA: Supplier Part: C19419644; Manufacturer: MICROCHIP(美国微芯); Supplier Footprint: PLCC-32(11.4x14); JLCPCB Part Class: Extended Part; Datasheet: https://atta.szlcsc.com/upload/public/pdf/source/20231219/D71B459663ED98E5759C4D9FD7C82D84.pdf; Supplier: LCSC
U7 U10-U12 U50 = SN74LS138DRE4: Supplier Part: C21427068; Manufacturer: TI(德州仪器); Supplier: LCSC
U8 U9 = CY62256LL-70ZXC: Supplier Part: C2950472; Manufacturer: CYPRESS(赛普拉斯); Supplier Footprint: TSSOP-28; JLCPCB Part Class: Extended Part; Supplier: LCSC
U51 U64-U82 = NOT
U52-U59 U63 = OR
S1 S1#2 S2 S2#2 S3-S9 = SWITCH,TACT,1.57N,3.9X2.9MM: Supplier Part: C9900022258; Supplier Footprint: SW-SMD_2P-L4.0-W3.0; JLCPCB Part Class: Extended Part; Supplier: LCSC
U60-U62 = AND
U13 = 8251A/BXA: Supplier Part: C3228905; Manufacturer: Rochester Electronics(罗彻斯特); JLCPCB Part Class: Extended Part; Supplier: LCSC
U14 U41 = MR8255A/B: Supplier Part: C3213520; Manufacturer: Rochester Electronics(罗彻斯特); JLCPCB Part Class: Extended Part; Datasheet: https://atta.szlcsc.com/upload/public/pdf/source/20241028/4EF61ABE3AAFD29D8B9BDFCEABED718D.pdf; Supplier: LCSC
LED1-LED10 = LED_0402-R: Supplier Footprint: 0402
U31-U38 = KCSA02-105: Supplier Part: C598235; Manufacturer: Kingbright; Supplier Footprint: SMD; JLCPCB Part Class: Extended Part; Datasheet: https://atta.szlcsc.com/upload/public/pdf/source/20230721/6E59C2168C4764E3E31805CCAFE28FF2.pdf; Supplier: LCSC
U17 = SN74LS244NSRG4: Supplier Part: C22160692; Manufacturer: TI(德州仪器); JLCPCB Part Class: Extended Part; Supplier: LCSC
U42 = LCD: Supplier Part: C9900094568; Supplier Footprint: 插件; JLCPCB Part Class: Extended Part; Supplier: LCSC
U43 = HD74LS245P: Supplier Part: C5349; Manufacturer: RENESAS(瑞萨)/IDT; Supplier Footprint: DIP-20; JLCPCB Part Class: Extended Part; Datasheet: https://atta.szlcsc.com/upload/public/pdf/source/20161119/1479540128687.pdf; Supplier: LCSC

## Nets
+5V: R1#2.2 R2#2.2 R3#2.2 R9.2 R10.2 R11.2 R12.2 R13.2 R14.2 R15.2 R16.2 R17.2 R18.2 U31.10(VCC) U32.10(VCC) U33.10(VCC) U34.10(VCC) U35.10(VCC) U36.10(VCC) U37.10(VCC) U38.10(VCC)
GND: C1.1 R1.2 R2.1 R4.1 U3.10(GND) U4.10(GND) U5.14(GND) U6.14(GND) U7.4(~E2) U7.6(~E1) U7.8(GND) U8.28(GND) U9.28(GND) U10.8(GND) U11.8(GND) U12.8(GND) U14.7(GND) U15.1(~OC) U15.10(GND) U16.1(~OC) U16.10(GND) U17.1(~1OE) U17.10(GND) U18.10(GND) U19.10(GND) U20.10(GND) U21.2(GND) U21.3(GND) U23.1(~OC) U23.10(GND) U24.1(~OC) U24.10(GND) U25.1(~OC) U25.10(GND) U26.1(~OC) U26.10(GND) U27.1(~OC) U27.10(GND) U28.1(~OC) U28.10(GND) U29.1(~OC) U29.10(GND) U30.1(~OC) U30.10(GND) U39.21(RESET) U41.35(RESET) U42.1(VSS) U49.1(~OC) U49.10(GND) U50.8(GND)
VCC: D5.1(K) R3.2 U3.20(VCC) U4.20(VCC) U5.28(VCC) U6.28(VCC) U7.16(VCC) U8.14(VCC) U9.14(VCC) U10.16(VCC) U11.16(VCC) U12.16(VCC) U14.26(VCC) U15.20(VCC) U16.20(VCC) U17.20(VCC) U18.20(VCC) U19.20(VCC) U20.20(VCC) U22.1(VCC) U23.20(VCC) U24.20(VCC) U25.20(VCC) U26.20(VCC) U27.20(VCC) U28.20(VCC) U29.20(VCC) U30.20(VCC) U49.20(VCC) U50.16(VCC)
Net-(C1-2): C1.2 D5.2(A) R3.1 R4.2 U2.11(~RES)
Net-(D1-1): D1.1(K) U16.2(Q1)
Net-(D1-2): D1.2(A) S1#2.c2(1) S4.c2(1) S7.c2(1)
Net-(D2-1): D2.1(K) U16.5(Q2)
Net-(D2-2): D2.2(A) S2#2.c2(1) S5.c2(1) S8.c2(1)
Net-(D3-1): D3.1(K) U16.6(Q3)
Net-(D3-2): D3.2(A) S3.c2(1) S6.c2(1) S9.c2(1)
Net-(LED1-1): LED1.1(A) R9.1
Net-(LED1-2): LED1.2(C) U15.2(Q1)
Net-(LED2-1): LED2.1(A) R10.1
Net-(LED2-2): LED2.2(C) U15.5(Q2)
Net-(LED3-1): LED3.1(A) R11.1
Net-(LED3-2): LED3.2(C) U15.6(Q3)
Net-(LED4-1): LED4.1(A) R12.1
Net-(LED4-2): LED4.2(C) U15.9(Q4)
Net-(LED5-1): LED5.1(A) R13.1
Net-(LED5-2): LED5.2(C) U15.12(Q5)
Net-(LED6-1): LED6.1(A) R14.1
Net-(LED6-2): LED6.2(C) U15.15(Q6)
Net-(LED7-1): LED7.1(A) R15.1
Net-(LED7-2): LED7.2(C) U15.17(Q7)
Net-(LED8-1): LED8.1(A) R16.1
Net-(LED8-2): LED8.2(C) U15.19(Q8)
Net-(LED9-1): LED9.1(A) R17.1
Net-(LED9-2): LED9.2(C) U49.2(Q1)
Net-(LED10-1): LED10.1(A) R18.1
Net-(LED10-2): LED10.2(C) U49.5(Q2)
Net-(R1#2-1): R1#2.1 S1#2.c1(2) S2#2.c1(2) S3.c1(2) U17.2(A1)
Net-(R1#3-1): R1#3.1 U23.2(Q1) U23.5(Q2) U23.6(Q3) U23.9(Q4) U23.12(Q5) U23.15(Q6) U23.17(Q7) U23.19(Q8)
Net-(R1#3-2): R1#3.2 U31.1(A) U31.2(B) U31.3(C) U31.4(D) U31.5(E) U31.6(F) U31.7(G)
Net-(R1-1): R1.1 U2.17(X1) Y1.2(GND)
Net-(R2#2-1): R2#2.1 S4.c1(2) S5.c1(2) S6.c1(2) U17.4(A2)
Net-(R2#3-1): R2#3.1 U24.2(Q1) U24.5(Q2) U24.6(Q3) U24.9(Q4) U24.12(Q5) U24.15(Q6) U24.17(Q7) U24.19(Q8)
Net-(R2#3-2): R2#3.2 U32.1(A) U32.2(B) U32.3(C) U32.4(D) U32.5(E) U32.6(F) U32.7(G)
Net-(R2-2): R2.2 U2.16(X2) Y1.1
Net-(R3#2-1): R3#2.1 S7.c1(2) S8.c1(2) S9.c1(2) U17.6(A3)
Net-(R3#3-1): R3#3.1 U25.2(Q1) U25.5(Q2) U25.6(Q3) U25.9(Q4) U25.12(Q5) U25.15(Q6) U25.17(Q7) U25.19(Q8)
Net-(R3#3-2): R3#3.2 U33.1(A) U33.2(B) U33.3(C) U33.4(D) U33.5(E) U33.6(F) U33.7(G)
Net-(R4#2-1): R4#2.1 U26.2(Q1) U26.5(Q2) U26.6(Q3) U26.9(Q4) U26.12(Q5) U26.15(Q6) U26.17(Q7) U26.19(Q8)
Net-(R4#2-2): R4#2.2 U34.1(A) U34.2(B) U34.3(C) U34.4(D) U34.5(E) U34.6(F) U34.7(G)
Net-(R5-1): R5.1 U27.2(Q1) U27.5(Q2) U27.6(Q3) U27.9(Q4) U27.12(Q5) U27.15(Q6) U27.17(Q7) U27.19(Q8)
Net-(R5-2): R5.2 U35.1(A) U35.2(B) U35.3(C) U35.4(D) U35.5(E) U35.6(F) U35.7(G)
Net-(R6-1): R6.1 U28.2(Q1) U28.5(Q2) U28.6(Q3) U28.9(Q4) U28.12(Q5) U28.15(Q6) U28.17(Q7) U28.19(Q8)
Net-(R6-2): R6.2 U36.1(A) U36.2(B) U36.3(C) U36.4(D) U36.5(E) U36.6(F) U36.7(G)
Net-(R7-1): R7.1 U29.2(Q1) U29.5(Q2) U29.6(Q3) U29.9(Q4) U29.12(Q5) U29.15(Q6) U29.17(Q7) U29.19(Q8)
Net-(R7-2): R7.2 U37.1(A) U37.2(B) U37.3(C) U37.4(D) U37.5(E) U37.6(F) U37.7(G)
Net-(R8-1): R8.1 U30.2(Q1) U30.5(Q2) U30.6(Q3) U30.9(Q4) U30.12(Q5) U30.15(Q6) U30.17(Q7) U30.19(Q8)
Net-(R8-2): R8.2 U38.1(A) U38.2(B) U38.3(C) U38.4(D) U38.5(E) U38.6(F) U38.7(G)
Net-(S1-c2): S1.c2(1) U10.14(~Y2)
Net-(S2-c2): S2.c2(1) U10.9(~Y7)
Net-(U1-2): U1.2(AD14) U4.8(A7) U18.14(D7)
Net-(U1-3): U1.3(AD13) U4.7(A6) U18.13(D6)
Net-(U1-4): U1.4(AD12) U4.6(A5) U18.8(D5)
Net-(U1-5): U1.5(AD11) U4.5(A4) U18.7(D4)
Net-(U1-6): U1.6(AD10) U4.4(A3) U18.4(D3)
Net-(U1-7): U1.7(AD9) U4.3(A2) U18.3(D2)
Net-(U1-8): U1.8(AD8) U4.2(A1) U18.18(D1)
Net-(U1-9): U1.9(AD7) U3.9(A8) U20.16(D8)
Net-(U1-10): U1.10(AD6) U3.8(A7) U20.14(D7)
Net-(U1-11): U1.11(AD5) U3.7(A6) U20.13(D6)
Net-(U1-12): U1.12(AD4) U3.6(A5) U20.8(D5)
Net-(U1-13): U1.13(AD3) U3.5(A4) U20.7(D4)
Net-(U1-14): U1.14(AD2) U3.4(A3) U20.4(D3)
Net-(U1-15): U1.15(AD1) U3.3(A2) U20.3(D2)
Net-(U1-16): U1.16(AD0) U3.2(A1) U20.18(D1)
Net-(U1-19): U1.19(CLK) U2.8(CLK)
Net-(U1-21): U1.21(RESET) U2.10(RESET)
Net-(U1-22): U1.22(READY) U2.5(READY)
Net-(U1-25): U1.25(QS0/ALE) U18.11(G) U19.11(G) U20.11(G)
Net-(U1-26): U1.26(~S0/DEN) U3.19(~G) U4.19(~G)
Net-(U1-27): U1.27(~S1/~DT/~R) U3.1(DIR) U4.1(DIR)
Net-(U1-33): U1.33(MN/~MX) U21.1(VCC)
Net-(U1-34): U1.34(~BHE/~S7) U19.8(D5)
Net-(U1-35): U1.35(A19/S6) U19.7(D4)
Net-(U1-36): U1.36(A18/S5) U19.4(D3)
Net-(U1-37): U1.37(A17/S4) U19.3(D2)
Net-(U1-38): U1.38(A16/S3) U19.18(D1)
Net-(U1-39): U1.39(AD15) U4.9(A8) U18.16(D8)
Net-(U2-1): U2.1(CSYNC) U2.13(F/~C) U22.2(GND)
Net-(U5-20): U5.20(~CE) U6.20(~CE) U7.14(~Y2)
Net-(U5-22): U5.22(~OE/~VPP) U6.22(~OE/~VPP) U8.13(~OE) U9.13(~OE)
Net-(U7-7): U7.7(~Y8) U52.1(A)
Net-(U8-11): U8.11(~CE) U9.11(~CE) U52.3(Y)
Net-(U10-2): U10.2(A1) U12.3(A2)
Net-(U10-3): U10.3(A2) U59.2(B) U62.1(A)
Net-(U10-4): U10.4(~E2) U63.3(Y)
Net-(U10-5): U10.5(E3) U61.3(Y)
Net-(U10-6): U10.6(~E1) U11.6(~E1) U12.6(~E1)
Net-(U11-1): U11.1(A0) U12.1(A0) U63.2(B)
Net-(U11-2): U11.2(A1) U12.2(A1) U60.1(A)
Net-(U11-4): U11.4(~E2) U59.3(Y)
Net-(U11-5): U11.5(E3) U60.2(B) U62.2(B)
Net-(U11-10): U11.10(~Y6) U70.1(A)
Net-(U11-12): U11.12(~Y4) U71.1(A)
Net-(U11-13): U11.13(~Y3) U72.1(A)
Net-(U12-4): U12.4(~E2) U57.3(Y) U59.1(A) U63.1(A)
Net-(U12-5): U12.5(E3) U62.3(Y)
Net-(U12-7): U12.7(~Y8) U64.1(A)
Net-(U12-9): U12.9(~Y7) U65.1(A)
Net-(U12-10): U12.10(~Y6) U66.1(A)
Net-(U12-11): U12.11(~Y5) U67.1(A)
Net-(U12-12): U12.12(~Y4) U68.1(A)
Net-(U12-13): U12.13(~Y3) U69.1(A)
Net-(U12-14): U12.14(~Y2) U81.1(A)
Net-(U12-15): U12.15(~Y1) U82.1(A)
Net-(U13-2): U13.2(RESET) U14.35(RESET)
Net-(U13-3): U13.3(C/~D) U14.9(A0)
Net-(U13-4): U13.4(~RD) U14.5(~RD)
Net-(U13-5): U13.5(~WR) U14.36(~WR)
Net-(U15-3): U15.3(D2) U15.4(D3) U15.7(D4) U15.8(D5) U15.13(D6) U15.14(D7) U15.16(D8) U15.18(D1) U49.3(D2) U49.18(D1)
Net-(U23-3): U23.3(D2) U23.4(D3) U23.7(D4) U23.8(D5) U23.13(D6) U23.14(D7) U23.16(D8) U23.18(D1) U24.3(D2) U24.4(D3) U24.7(D4) U24.8(D5) U24.13(D6) U24.14(D7) U24.16(D8) U24.18(D1) U25.3(D2) U25.4(D3) U25.7(D4) U25.8(D5) U25.13(D6) U25.14(D7) U25.16(D8) U25.18(D1) U26.3(D2) U26.4(D3) U26.7(D4) U26.8(D5) U26.13(D6) U26.14(D7) U26.16(D8) U26.18(D1) U27.3(D2) U27.4(D3) U27.7(D4) U27.8(D5) U27.13(D6) U27.14(D7) U27.16(D8) U27.18(D1) U28.3(D2) U28.4(D3) U28.7(D4) U28.8(D5) U28.13(D6) U28.14(D7) U28.16(D8) U28.18(D1) U29.3(D2) U29.4(D3) U29.7(D4) U29.8(D5) U29.13(D6) U29.14(D7) U29.16(D8) U29.18(D1) U30.3(D2) U30.4(D3) U30.7(D4) U30.8(D5) U30.13(D6) U30.14(D7) U30.16(D8) U30.18(D1)
Net-(U23-11): U23.11(G) U73.2(Y)
Net-(U24-11): U24.11(G) U74.2(Y)
Net-(U25-11): U25.11(G) U75.2(Y)
Net-(U26-11): U26.11(G) U76.2(Y)
Net-(U27-11): U27.11(G) U77.2(Y)
Net-(U28-11): U28.11(G) U78.2(Y)
Net-(U29-11): U29.11(G) U79.2(Y)
Net-(U30-11): U30.11(G) U80.2(Y)
Net-(U39-22): U39.22(READY) U39.33(MN/~MX)
Net-(U39-26): U39.26(~S0/DEN) U43.10(CE)
Net-(U39-27): U39.27(~S1/~DT/~R) U43.1(AB/BA)
Net-(U39-29): U39.29(~LOCK/WR) U41.36(~WR)
Net-(U41-1): U41.1(PA3) U42.10(D3)
Net-(U41-2): U41.2(PA2) U42.9(D2)
Net-(U41-3): U41.3(PA1) U42.8(D1)
Net-(U41-4): U41.4(PA0) U42.7(D0)
Net-(U41-18): U41.18(PB0) U42.4(RS)
Net-(U41-19): U41.19(PB1) U42.5(RW)
Net-(U41-20): U41.20(PB2) U42.6(E)
Net-(U41-27): U41.27(D7) U43.11(B7)
Net-(U41-28): U41.28(D6) U43.12(B6)
Net-(U41-29): U41.29(D5) U43.13(B5)
Net-(U41-30): U41.30(D4) U43.14(B4)
Net-(U41-31): U41.31(D3) U43.15(B3)
Net-(U41-32): U41.32(D2) U43.16(B2)
Net-(U41-33): U41.33(D1) U43.17(B1)
Net-(U41-34): U41.34(D0) U43.18(B0)
Net-(U41-37): U41.37(PA7) U42.14(D7)
Net-(U41-38): U41.38(PA6) U42.13(D6)
Net-(U41-39): U41.39(PA5) U42.12(D5)
Net-(U41-40): U41.40(PA4) U42.11(D4)
Net-(U42-2): U42.2(VDD) U42.3(VEE)
Net-(U50-7): U50.7(~Y8) U80.1(A)
Net-(U50-9): U50.9(~Y7) U79.1(A)
Net-(U50-10): U50.10(~Y6) U78.1(A)
Net-(U50-11): U50.11(~Y5) U77.1(A)
Net-(U50-12): U50.12(~Y4) U76.1(A)
Net-(U50-13): U50.13(~Y3) U75.1(A)
Net-(U50-14): U50.14(~Y2) U74.1(A)
Net-(U50-15): U50.15(~Y1) U73.1(A)
Net-(U51-2): U51.2(Y) U52.2(B)
Net-(U53-2): U53.2(B) U54.1(A)
Net-(U55-3): U55.3(Y) U57.1(A)
Net-(U56-3): U56.3(Y) U57.2(B)
Net-(U58-3): U58.3(Y) U61.2(B)
Net-(U60-3): U60.3(Y) U61.1(A)

Not connected (* = marked no-connect by the designer): S1 c1(2); S2 c1(2); U1 17(NMI) 18(INTR) 23(~TEST) 24(QS1/~INTA) 28(~S2/~M/~I0) 29(~LOCK/WR) 30(~RQ/GT1/~HLDA) 31(~RQ/GT0/~HOLD) 32(~RD); U2 2(PCLK) 3(~AEN1) 4(RDY1) 6(RDY2) 7(~AEN2) 12(OSC) 14(EFI) 15(~ASYNC); U3 11(B1) 12(B2) 13(B3) 14(B4) 15(B5) 16(B6) 17(B7) 18(B8); U4 11(B1) 12(B2) 13(B3) 14(B4) 15(B5) 16(B6) 17(B7) 18(B8); U5 1(A15) 2(A12) 3(A7) 4(A6) 5(A5) 6(A4) 7(A3) 8(A2) 9(A1) 10(A0) 11(O0) 12(O1) 13(O2) 15(O3) 16(O4) 17(O5) 18(O6) 19(O7) 21(A10) 23(A11) 24(A9) 25(A8) 26(A13) 27(A14); U6 1(A15) 2(A12) 3(A7) 4(A6) 5(A5) 6(A4) 7(A3) 8(A2) 9(A1) 10(A0) 11(O0) 12(O1) 13(O2) 15(O3) 16(O4) 17(O5) 18(O6) 19(O7) 21(A10) 23(A11) 24(A9) 25(A8) 26(A13) 27(A14); U7 1(A0) 2(A1) 3(A2) 5(E3) 9(~Y7) 10(~Y6) 11(~Y5) 12(~Y4) 13(~Y3) 15(~Y1); U8 1(A10) 2(A9) 3(A8) 4(A7) 5(A6) 6(A5) 7(A4) 8(A3) 9(A2) 10(A14) 12(~WE) 15(A13) 16(A12) 17(A11) 18(A1) 19(A0) 20(I/O7) 21(I/O6) 22(I/O5) 23(I/O4) 24(I/O3) 25(I/O2) 26(I/O1) 27(I/O0); U9 1(A10) 2(A9) 3(A8) 4(A7) 5(A6) 6(A5) 7(A4) 8(A3) 9(A2) 10(A14) 12(~WE) 15(A13) 16(A12) 17(A11) 18(A1) 19(A0) 20(I/O7) 21(I/O6) 22(I/O5) 23(I/O4) 24(I/O3) 25(I/O2) 26(I/O1) 27(I/O0); U10 1(A0) 7(~Y8) 10(~Y6) 11(~Y5) 12(~Y4) 13(~Y3) 15(~Y1); U11 3(A2) 7(~Y8) 9(~Y7) 11(~Y5) 14(~Y2) 15(~Y1); U13 1(~CS) 6(CLK) 7(RxD) 8(~RxC) 9(~TxC) 10(~DSR) 11(~CTS) 12(D0) 13(D1) 14(D2) 15(TxD) 16(SYNDET/BD) 17(TxRDY) 18(D7) 19(D6) 20(D5) 21(D4) 22(D3) 23(~RTS) 24(~DTR) 25(RxRDY) 26(TxEMPTY); U14 1(PA3) 2(PA2) 3(PA1) 4(PA0) 6(~CS) 8(A1) 10(PC7) 11(PC6) 12(PC5) 13(PC4) 14(PC0) 15(PC1) 16(PC2) 17(PC3) 18(PB0) 19(PB1) 20(PB2) 21(PB3) 22(PB4) 23(PB5) 24(PB6) 25(PB7) 27(D7) 28(D6) 29(D5) 30(D4) 31(D3) 32(D2) 33(D1) 34(D0) 37(PA7) 38(PA6) 39(PA5) 40(PA4); U15 11(G); U16 3(D2) 4(D3) 7(D4) 8(D5) 9(Q4) 11(G) 12(Q5) 13(D6) 14(D7) 15(Q6) 16(D8) 17(Q7) 18(D1) 19(Q8); U17 3(Y8) 5(Y7) 7(Y6) 8(A4) 9(Y5) 11(Y1) 12(A8) 13(Y2) 14(A7) 15(Y3) 16(A6) 17(Y4) 18(A5) 19(~2OE); U18 1(~OC) 2(Q1) 5(Q2) 6(Q3) 9(Q4) 12(Q5) 15(Q6) 17(Q7) 19(Q8); U19 1(~OC) 2(Q1) 5(Q2) 6(Q3) 9(Q4) 12(Q5) 13(D6) 14(D7) 15(Q6) 16(D8) 17(Q7) 19(Q8); U20 1(~OC) 2(Q1) 5(Q2) 6(Q3) 9(Q4) 12(Q5) 15(Q6) 17(Q7) 19(Q8); U31 8(CA) 9(DP); U32 8(CA) 9(DP); U33 8(CA) 9(DP); U34 8(CA) 9(DP); U35 8(CA) 9(DP); U36 8(CA) 9(DP); U37 8(CA) 9(DP); U38 8(CA) 9(DP); U39 2(AD14) 3(AD13) 4(AD12) 5(AD11) 6(AD10) 7(AD9) 8(AD8) 9(AD7) 10(AD6) 11(AD5) 12(AD4) 13(AD3) 14(AD2) 15(AD1) 16(AD0) 17(NMI) 18(INTR) 19(CLK) 23(~TEST) 24(QS1/~INTA) 25(QS0/ALE) 28(~S2/~M/~I0) 30(~RQ/GT1/~HLDA) 31(~RQ/GT0/~HOLD) 32(~RD) 34(~BHE/~S7) 35(A19/S6) 36(A18/S5) 37(A17/S4) 38(A16/S3) 39(AD15); U41 5(~RD) 6(~CS) 7(GND) 8(A1) 9(A0) 10(PC7) 11(PC6) 12(PC5) 13(PC4) 14(PC0) 15(PC1) 16(PC2) 17(PC3) 21(PB3) 22(PB4) 23(PB5) 24(PB6) 25(PB7) 26(VCC); U43 2(A0) 3(A1) 4(A2) 5(A3) 6(A4) 7(A5) 8(A6) 9(A7); U49 4(D3) 6(Q3) 7(D4) 8(D5) 9(Q4) 11(G) 12(Q5) 13(D6) 14(D7) 15(Q6) 16(D8) 17(Q7) 19(Q8); U50 1(A0) 2(A1) 3(A2) 4(~E2) 5(E3) 6(~E1); U51 1(A); U53 1(A) 3(Y); U54 2(B) 3(Y); U55 1(A) 2(B); U56 1(A) 2(B); U58 1(A) 2(B); U64 2(Y); U65 2(Y); U66 2(Y); U67 2(Y); U68 2(Y); U69 2(Y); U70 2(Y); U71 2(Y); U72 2(Y); U81 2(Y); U82 2(Y)

## Notes on the sheets
sheet 2
- /BHE
- /HWR
- /WR
- D15-8
- A15-0
- D15-8
- /LWR
- A0
- /HWR
- A15-0
- /RD
- D7-0
- D7-0
- A15-0
- /LWR
- M/ /IO
- A17
- A18
- A19
- A16
sheet 3
- A15
- A14
- M/ /I0
- /S55
- A8
- A13
- /S51
- A12
- SL2
- SL1
- A4
- A5
- A11
- /ST2
- A7
- SA8
- A9
- ST1
- A10
- SA7
- A6
- SA6
- SA5
- SA4
- SA3
- SA2
- SA1
sheet 4
- RESET
- /RD
- /WR
- A2
- A1
- /S51
- /S55
- PA7-0
- PCLK
- TX
- RX
- PB7-0
- PC7-0
- D7-0
sheet 5
- SL1
- D7-0
- SL2
sheet 6
- ~ST2
- D0
- D1
- ST1
- D0
- D1
sheet 7
- D7-0
- M/ /IO
- A0
- 1
- A5
- A6
- A7
